# EAGLE schematic xio (EAGLE 9.5.0)

## Sheet 1 of 12: Block diagram
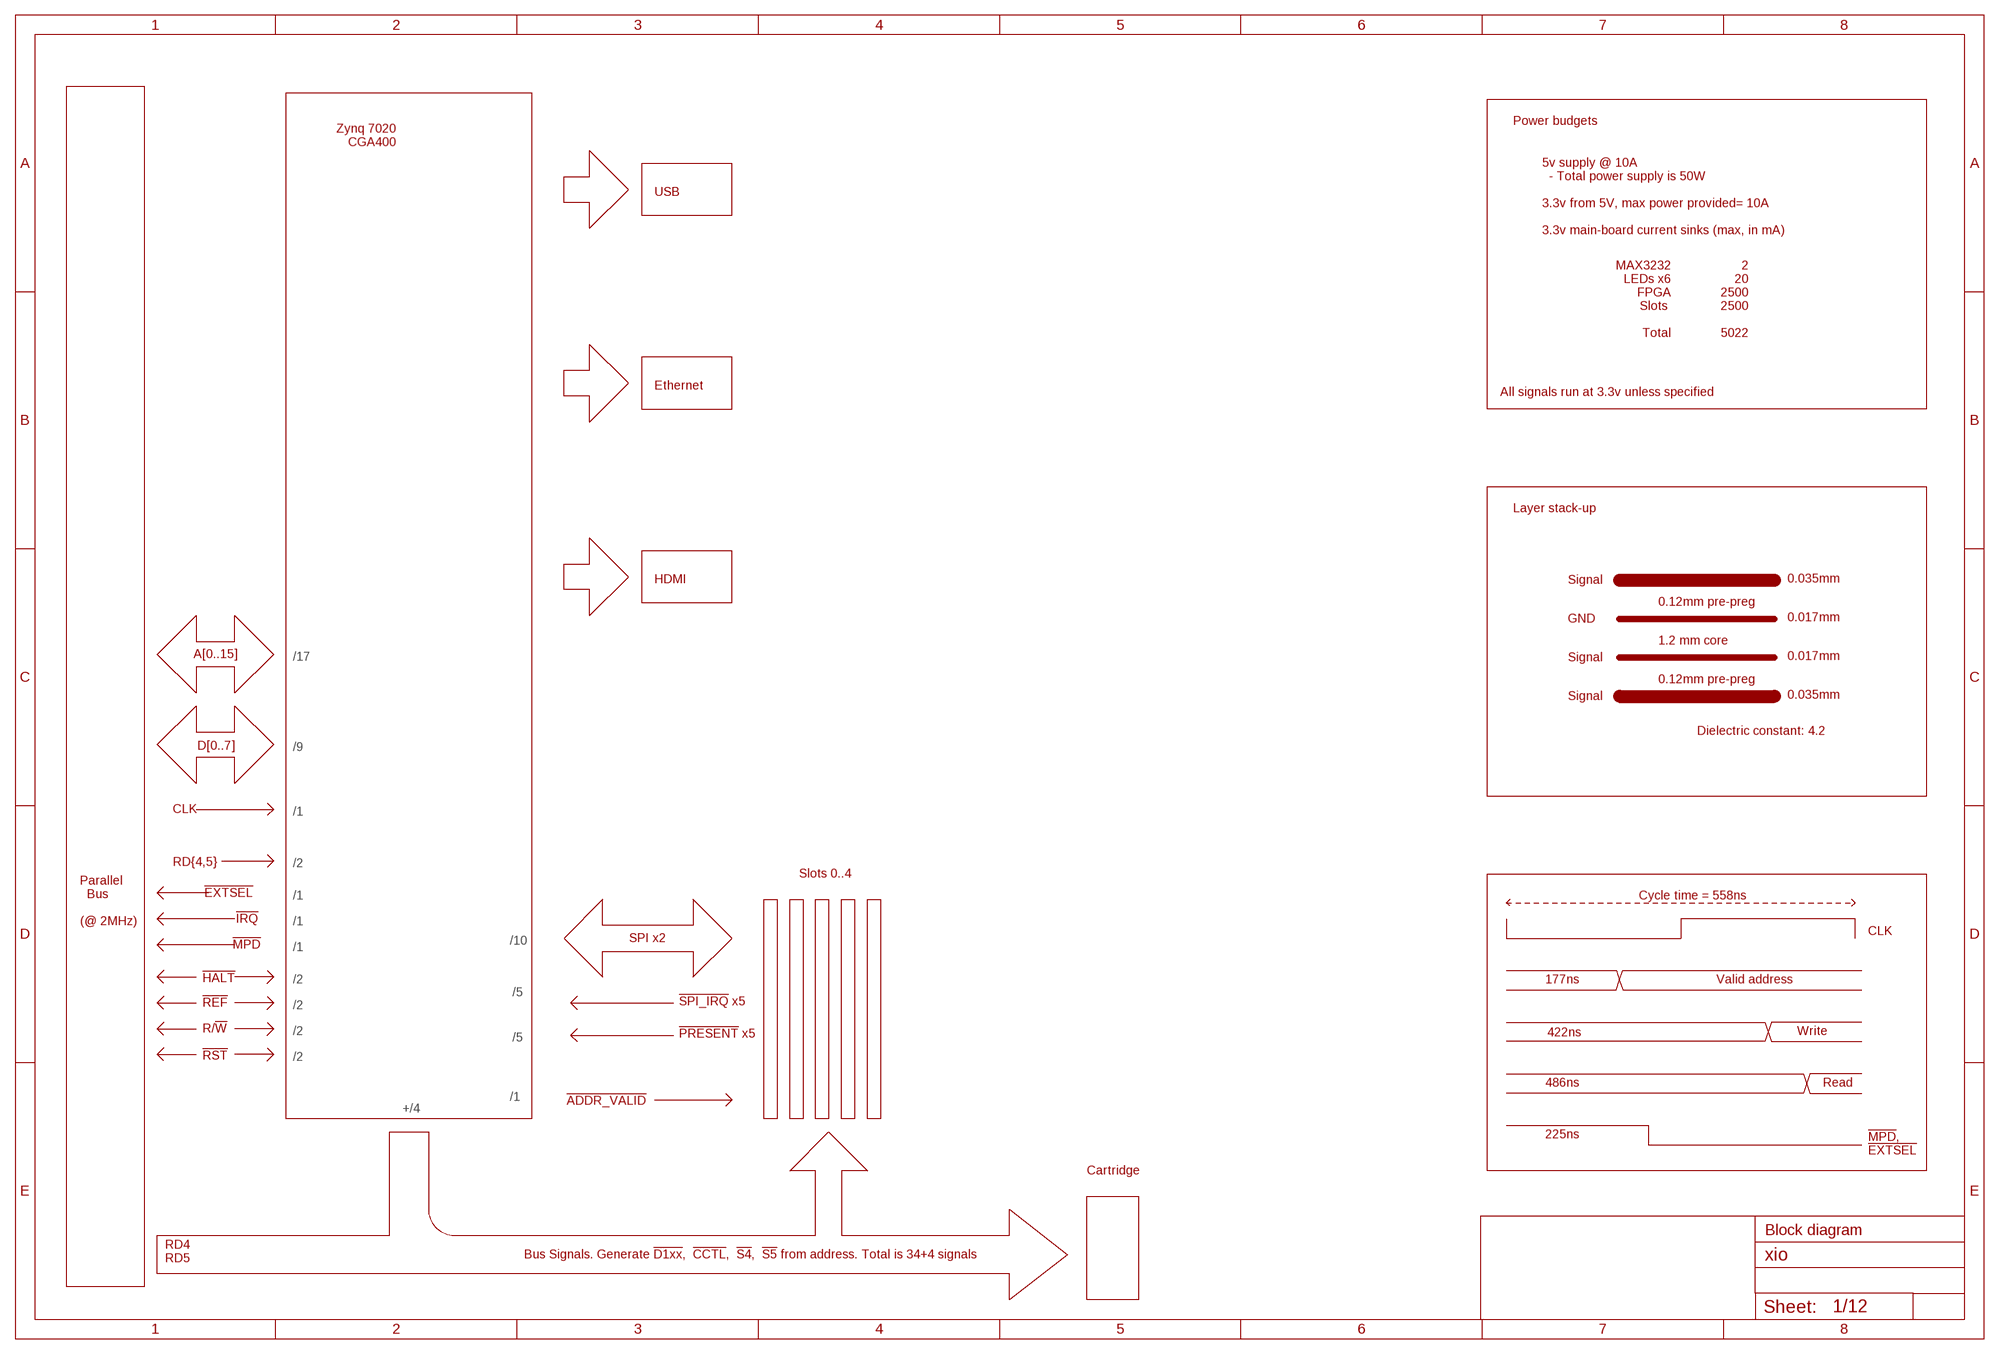
[diagram p0: schematic, sheet 1]

### Notes on the sheet
- Zynq 7020
   CGA400
- Power budgets
- USB
- 5v supply @ 10A
    - Total power supply is 50W
  
  3.3v from 5V, max power provided= 10A 
  
  3.3v main-board current sinks (max, in mA)
- MAX3232
  LEDs x6
  FPGA
  Slots 
  
  Total
- 2
  20
  2500
  2500
  
  5022
- Ethernet
- All signals run at 3.3v unless specified
- Layer stack-up
- HDMI | Signal | 0.035mm
- 0.12mm pre-preg
- GND | 0.017mm
- 1.2 mm core
- A[0..15] | /17 | Signal | 0.017mm
- 0.12mm pre-preg
- Signal | 0.035mm
- Dielectric constant: 4.2
- D[0..7] | /9
- CLK | /1
- RD{4,5} | /2
- Slots 0..4
- !EXTSEL!
- /1 | Cycle time = 558ns
- !IRQ!
- Parallel
    Bus
  
  (@ 2MHz)
- /1
- CLK
- !MPD! | SPI x2
- /10
- /1
- !HALT! | /2 | 177ns | Valid address
- /5
- !REF! | !SPI_IRQ! x5
- /2
- R/!W! | /2 | Write
- !PRESENT! x5 | 422ns
- /5
- !RST! | /2
- 486ns | Read
- /1
- !ADDR_VALID!
- +/4
- 225ns
- !MPD!,
  !EXTSEL!
- Cartridge
- Block diagram
- Bus Signals. Generate !D1xx!,  !CCTL!,  !S4!,  !S5! from address. Total is 34+4 signals
- RD4
  RD5

## Sheet 2 of 12: High voltage signalling
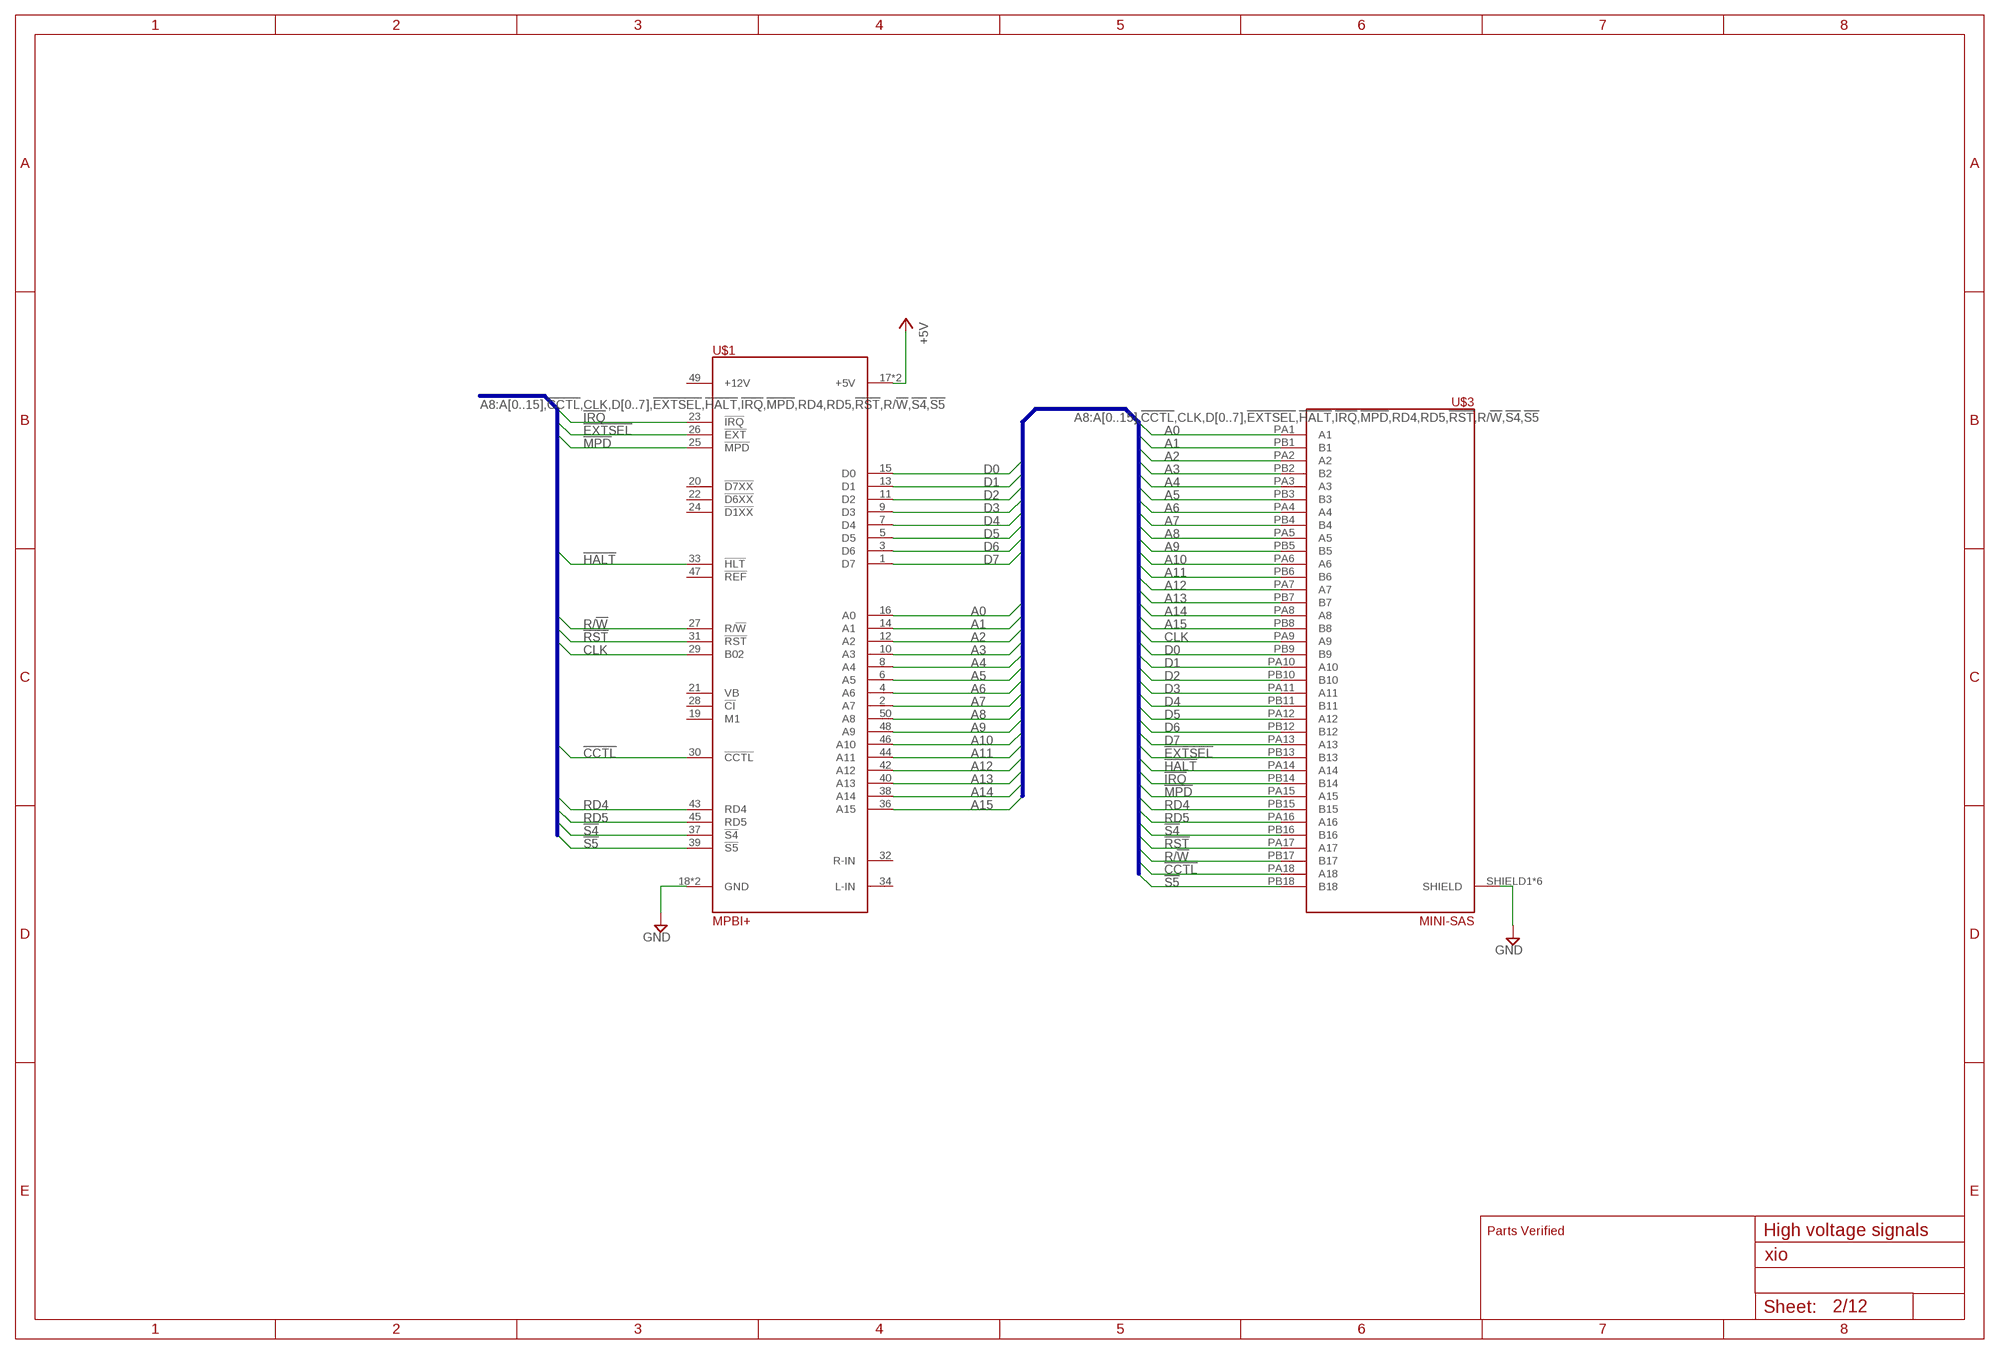
[diagram p1: schematic, sheet 2]

### Parts
U$1  MPBI+  [2X25]
U$3  MINI-SAS  [MINI-SAS]

### Nets
!CCTL!: U$1.30(!CCTL!) U$3.PA18(A18)
!EXTSEL!: U$1.26(!EXT!) U$3.PB13(B13)
!HALT!: U$1.33(!HLT!) U$3.PA14(A14)
!IRQ!: U$1.23(!IRQ!) U$3.PB14(B14)
!MPD!: U$1.25(!MPD!) U$3.PA15(A15)
!RST!: U$1.31(!RST!) U$3.PA17(A17)
!S4!: U$1.37(!S4!) U$3.PB16(B16)
!S5!: U$1.39(!S5!) U$3.PB18(B18)
+5V [Power]: U$1.17(+5V) U$1.41(+5V) ; also sheet 3,4,5
A0: U$1.16(A0) U$3.PA1(A1) ; also sheet 3,4,5
A1: U$1.14(A1) U$3.PB1(B1) ; also sheet 3,4,5
A2: U$1.12(A2) U$3.PA2(A2) ; also sheet 3,4,5
A3: U$1.10(A3) U$3.PB2(B2) ; also sheet 3,4,5
A4: U$1.8(A4) U$3.PA3(A3) ; also sheet 3,4,5
A5: U$1.6(A5) U$3.PB3(B3) ; also sheet 3,4,5
A6: U$1.4(A6) U$3.PA4(A4) ; also sheet 3,4,5
A7: U$1.2(A7) U$3.PB4(B4) ; also sheet 3,4,5
A8: U$1.50(A8) U$3.PA5(A5) ; also sheet 3,4,5
A9: U$1.48(A9) U$3.PB5(B5) ; also sheet 3,4,5
A10: U$1.46(A10) U$3.PA6(A6) ; also sheet 3,4,5
A11: U$1.44(A11) U$3.PB6(B6) ; also sheet 3,4,5
A12: U$1.42(A12) U$3.PA7(A7) ; also sheet 3,4,5
A13: U$1.40(A13) U$3.PB7(B7) ; also sheet 3,4,5
A14: U$1.38(A14) U$3.PA8(A8) ; also sheet 3,4,5
A15: U$1.36(A15) U$3.PB8(B8) ; also sheet 3,4,5
CLK: U$1.29(B02) U$3.PA9(A9)
D0: U$1.15(D0) U$3.PB9(B9) ; also sheet 3,4,5
D1: U$1.13(D1) U$3.PA10(A10) ; also sheet 3,4,5
D2: U$1.11(D2) U$3.PB10(B10) ; also sheet 3,4,5
D3: U$1.9(D3) U$3.PA11(A11) ; also sheet 3,4,5
D4: U$1.7(D4) U$3.PB11(B11) ; also sheet 3,4,5
D5: U$1.5(D5) U$3.PA12(A12) ; also sheet 3,4,5
D6: U$1.3(D6) U$3.PB12(B12) ; also sheet 3,4,5
D7: U$1.1(D7) U$3.PA13(A13) ; also sheet 3,4,5
GND: U$1.18(GND) U$1.35(GND) U$3.SHIELD1(SHIELD) U$3.SHIELD2(SHIELD) U$3.SHIELD3(SHIELD) U$3.SHIELD4(SHIELD) U$3.SHIELD5(SHIELD) U$3.SHIELD6(SHIELD) ; also sheet 3,4,5
R/!W!: U$1.27(R/!W!) U$3.PB17(B17)
RD4: U$1.43(RD4) U$3.PB15(B15)
RD5: U$1.45(RD5) U$3.PA16(A16)
Unconnected: U$1.19(M1) U$1.20(!D7XX!) U$1.21(VB) U$1.22(!D6XX!) U$1.24(!D1XX!) U$1.28(!CI!) U$1.32(R-IN) U$1.34(L-IN) U$1.47(!REF!) U$1.49(+12V)

### Buses
A8:A[0..15],!CCTL!,CLK,D[0..7],!EXTSEL!,!HALT!,!IRQ!,!MPD!,RD4,RD5,!RST!,R/!W!,!S4!,!S5!

### Notes on the sheet
- Parts Verified | High voltage signals

## Sheet 3 of 12: Expansion slots 0 & 1
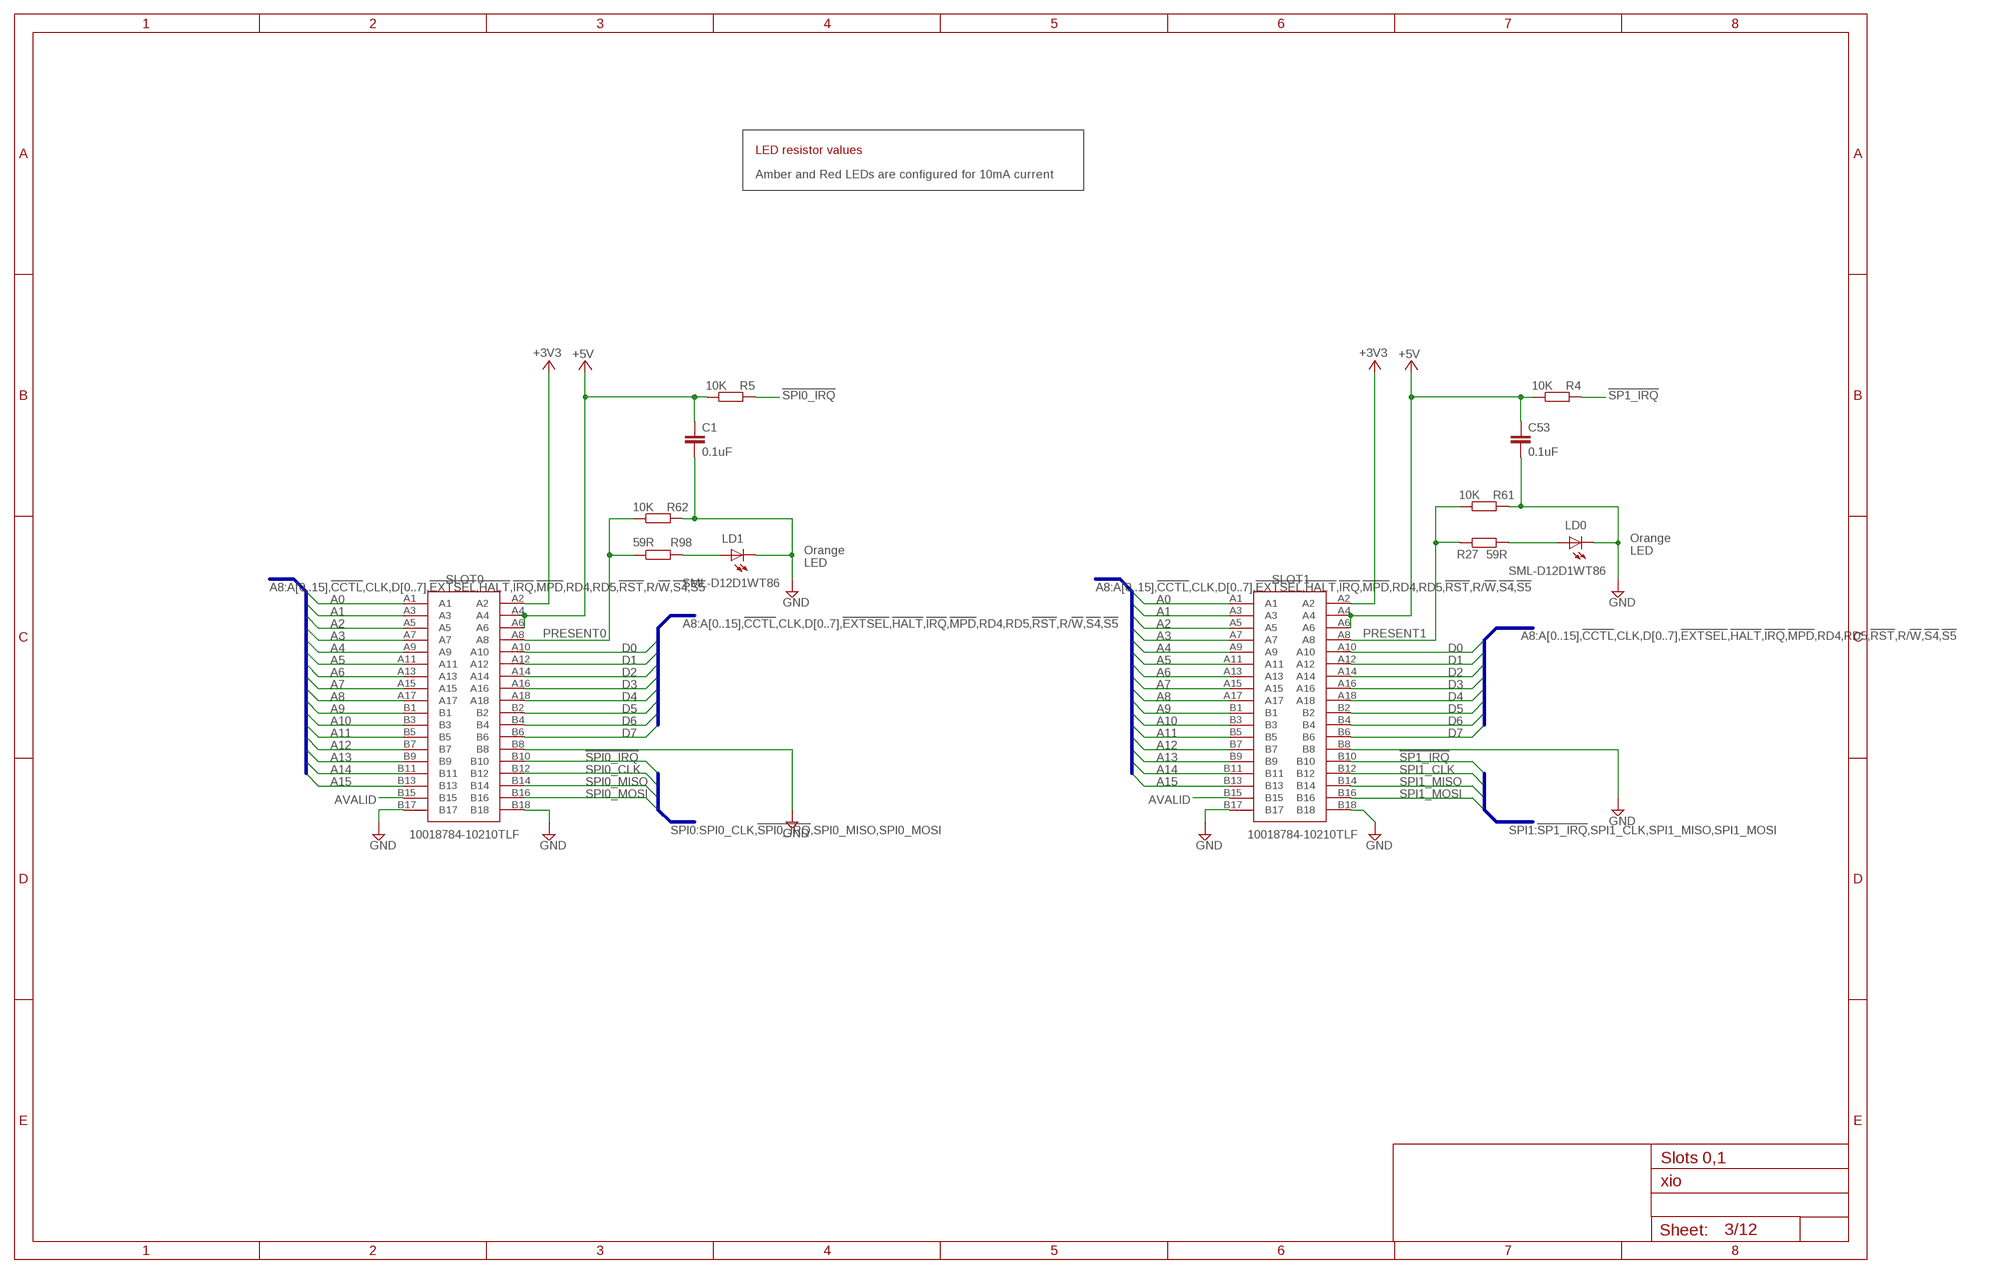
[diagram p2: schematic, sheet 3]

### Parts
C1  0.1uF  C-EUC0201  [C0201]
C53  0.1uF  C-EUC0201  [C0201]
LD0  SML-D12D1WT86  LEDCHIPLED_0603  [CHIPLED_0603]
LD1  SML-D12D1WT86  LEDCHIPLED_0603  [CHIPLED_0603]
R4  10K  R-EU_R0201  [R0201]
R5  10K  R-EU_R0201  [R0201]
R27  59R  R-EU_R0402  [R0402]
R61  10K  R-EU_R0201  [R0201]
R62  10K  R-EU_R0201  [R0201]
R98  59R  R-EU_R0402  [R0402]
SLOT0  10018784-10210TLF  [1001878410210TLF]
SLOT1  10018784-10210TLF  [1001878410210TLF]

### Nets
!SP1_IRQ!: R4.2 SLOT1.B10
!SPI0_IRQ!: R5.2 SLOT0.B10
+3V3 [lcd]: SLOT0.A2 SLOT1.A2 ; also sheet 4,5
+5V [Power]: C1.1 C53.1 R4.1 R5.1 SLOT0.A4 SLOT0.A6 SLOT1.A4 SLOT1.A6 ; also sheet 2,4,5
A0: SLOT0.A1 SLOT1.A1 ; also sheet 2,4,5
A1: SLOT0.A3 SLOT1.A3 ; also sheet 2,4,5
A2: SLOT0.A5 SLOT1.A5 ; also sheet 2,4,5
A3: SLOT0.A7 SLOT1.A7 ; also sheet 2,4,5
A4: SLOT0.A9 SLOT1.A9 ; also sheet 2,4,5
A5: SLOT0.A11 SLOT1.A11 ; also sheet 2,4,5
A6: SLOT0.A13 SLOT1.A13 ; also sheet 2,4,5
A7: SLOT0.A15 SLOT1.A15 ; also sheet 2,4,5
A8: SLOT0.A17 SLOT1.A17 ; also sheet 2,4,5
A9: SLOT0.B1 SLOT1.B1 ; also sheet 2,4,5
A10: SLOT0.B3 SLOT1.B3 ; also sheet 2,4,5
A11: SLOT0.B5 SLOT1.B5 ; also sheet 2,4,5
A12: SLOT0.B7 SLOT1.B7 ; also sheet 2,4,5
A13: SLOT0.B9 SLOT1.B9 ; also sheet 2,4,5
A14: SLOT0.B11 SLOT1.B11 ; also sheet 2,4,5
A15: SLOT0.B13 SLOT1.B13 ; also sheet 2,4,5
AVALID: SLOT0.B15 SLOT1.B15 ; also sheet 4,5
D0: SLOT0.A10 SLOT1.A10 ; also sheet 2,4,5
D1: SLOT0.A12 SLOT1.A12 ; also sheet 2,4,5
D2: SLOT0.A14 SLOT1.A14 ; also sheet 2,4,5
D3: SLOT0.A16 SLOT1.A16 ; also sheet 2,4,5
D4: SLOT0.A18 SLOT1.A18 ; also sheet 2,4,5
D5: SLOT0.B2 SLOT1.B2 ; also sheet 2,4,5
D6: SLOT0.B4 SLOT1.B4 ; also sheet 2,4,5
D7: SLOT0.B6 SLOT1.B6 ; also sheet 2,4,5
GND: C1.2 C53.2 LD0.C LD1.C R61.2 R62.2 SLOT0.B8 SLOT0.B17 SLOT0.B18 SLOT1.B8 SLOT1.B17 SLOT1.B18 ; also sheet 2,4,5
N$3: LD1.A R98.2
N$5: LD0.A R27.2
PRESENT0: R62.1 R98.1 SLOT0.A8
PRESENT1: R27.1 R61.1 SLOT1.A8
SPI0_CLK: SLOT0.B12
SPI0_MISO: SLOT0.B14
SPI0_MOSI: SLOT0.B16
SPI1_CLK: SLOT1.B12
SPI1_MISO: SLOT1.B14
SPI1_MOSI: SLOT1.B16

### Buses
A8:A[0..15],!CCTL!,CLK,D[0..7],!EXTSEL!,!HALT!,!IRQ!,!MPD!,RD4,RD5,!RST!,R/!W!,!S4!,!S5!
SPI1:!SP1_IRQ!,SPI1_CLK,SPI1_MISO,SPI1_MOSI
SPI0:SPI0_CLK,!SPI0_IRQ!,SPI0_MISO,SPI0_MOSI

### Notes on the sheet
- LED resistor values
- Amber and Red LEDs are configured for 10mA current
- Orange
  LED
- Orange
  LED
- Slots 0,1

## Sheet 4 of 12: Expansion slots 2 & 3
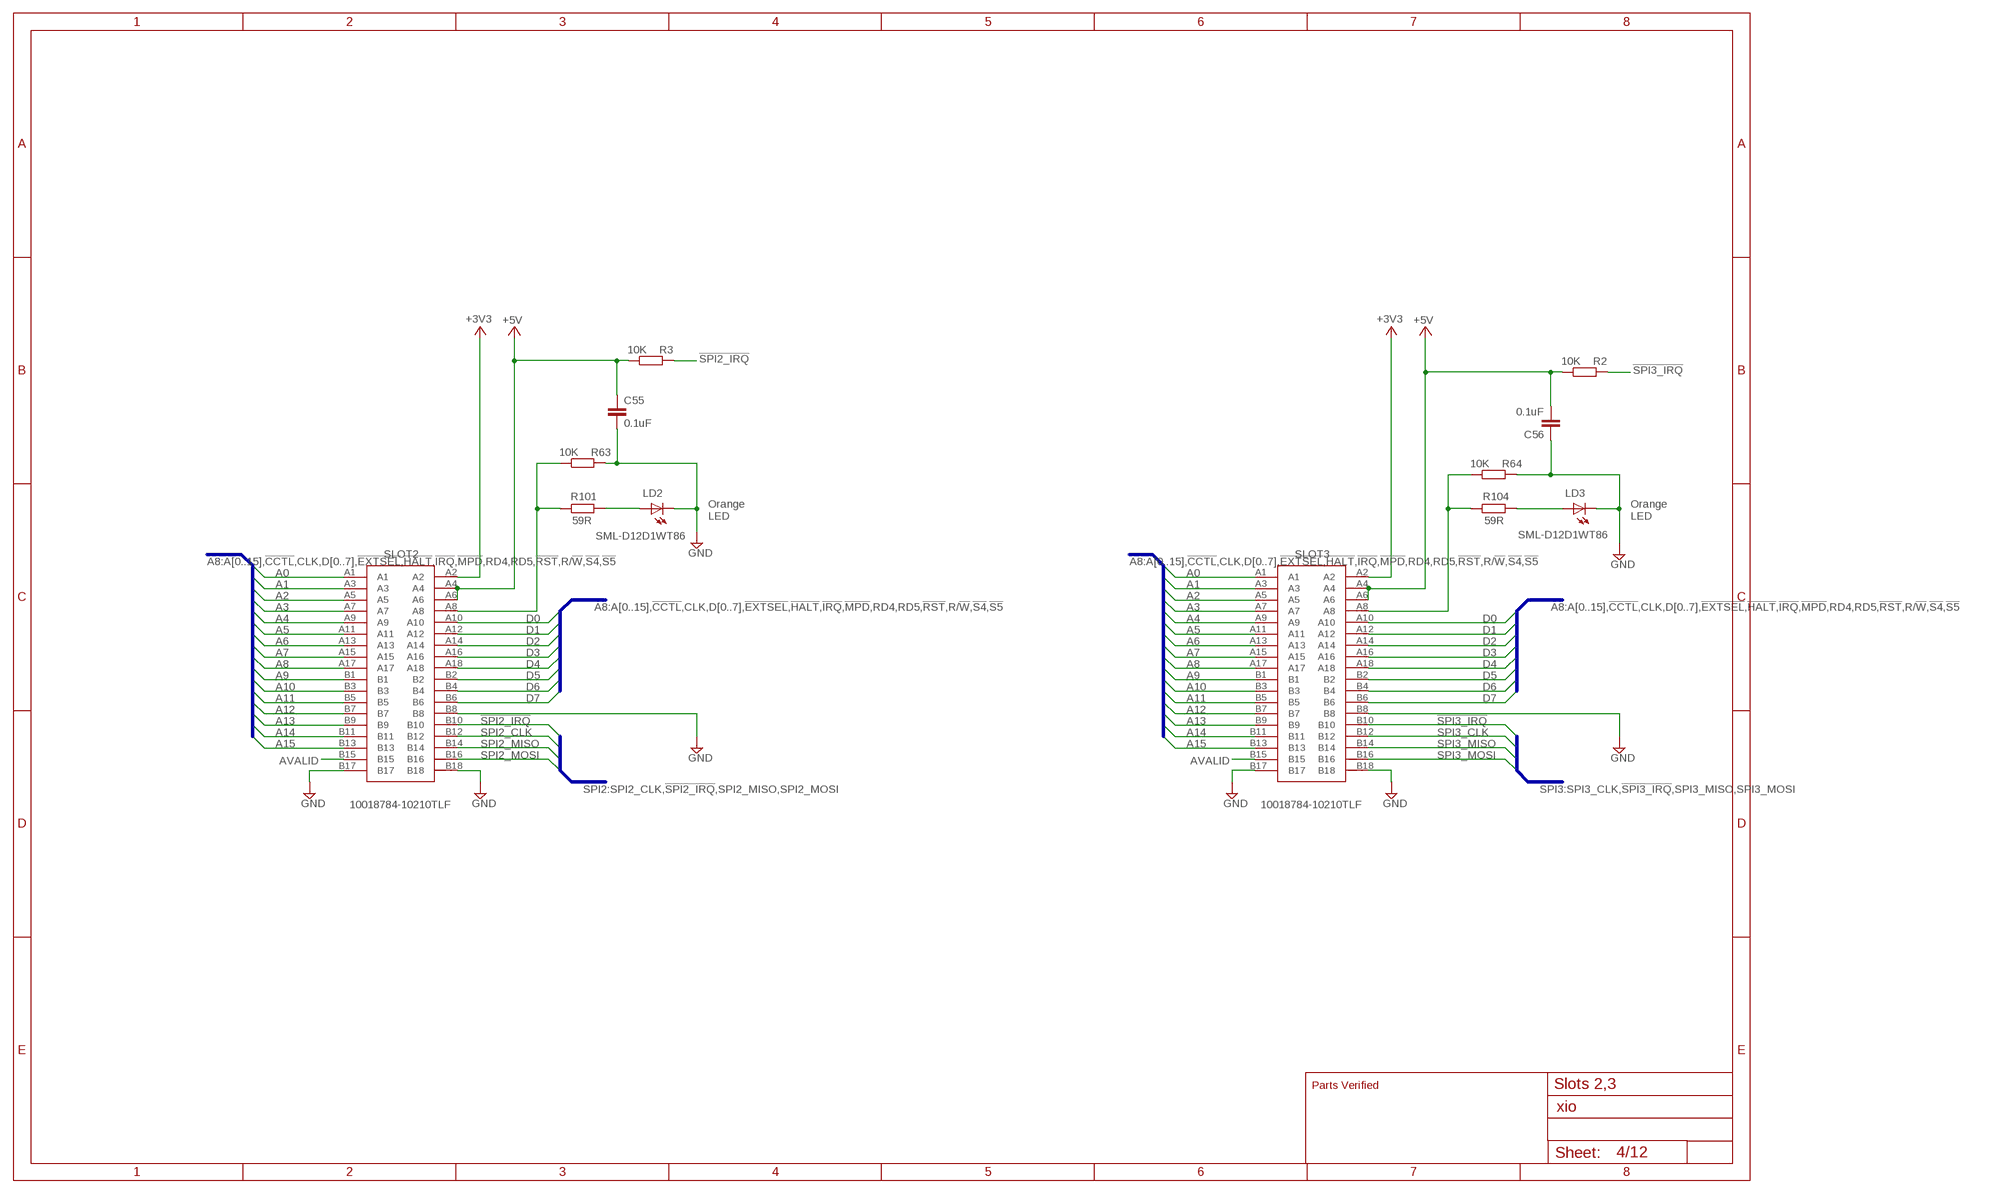
[diagram p3: schematic, sheet 4]

### Parts
C55  0.1uF  C-EUC0201  [C0201]
C56  0.1uF  C-EUC0201  [C0201]
LD2  SML-D12D1WT86  LEDCHIPLED_0603  [CHIPLED_0603]
LD3  SML-D12D1WT86  LEDCHIPLED_0603  [CHIPLED_0603]
R2  10K  R-EU_R0201  [R0201]
R3  10K  R-EU_R0201  [R0201]
R63  10K  R-EU_R0201  [R0201]
R64  10K  R-EU_R0201  [R0201]
R101  59R  R-EU_R0402  [R0402]
R104  59R  R-EU_R0402  [R0402]
SLOT2  10018784-10210TLF  [1001878410210TLF]
SLOT3  10018784-10210TLF  [1001878410210TLF]

### Nets
!SPI2_IRQ!: R3.2 SLOT2.B10
!SPI3_IRQ!: R2.2 SLOT3.B10
+3V3 [lcd]: SLOT2.A2 SLOT3.A2 ; also sheet 3,5
+5V [Power]: C55.1 C56.2 R2.1 R3.1 SLOT2.A4 SLOT2.A6 SLOT3.A4 SLOT3.A6 ; also sheet 2,3,5
A0: SLOT2.A1 SLOT3.A1 ; also sheet 2,3,5
A1: SLOT2.A3 SLOT3.A3 ; also sheet 2,3,5
A2: SLOT2.A5 SLOT3.A5 ; also sheet 2,3,5
A3: SLOT2.A7 SLOT3.A7 ; also sheet 2,3,5
A4: SLOT2.A9 SLOT3.A9 ; also sheet 2,3,5
A5: SLOT2.A11 SLOT3.A11 ; also sheet 2,3,5
A6: SLOT2.A13 SLOT3.A13 ; also sheet 2,3,5
A7: SLOT2.A15 SLOT3.A15 ; also sheet 2,3,5
A8: SLOT2.A17 SLOT3.A17 ; also sheet 2,3,5
A9: SLOT2.B1 SLOT3.B1 ; also sheet 2,3,5
A10: SLOT2.B3 SLOT3.B3 ; also sheet 2,3,5
A11: SLOT2.B5 SLOT3.B5 ; also sheet 2,3,5
A12: SLOT2.B7 SLOT3.B7 ; also sheet 2,3,5
A13: SLOT2.B9 SLOT3.B9 ; also sheet 2,3,5
A14: SLOT2.B11 SLOT3.B11 ; also sheet 2,3,5
A15: SLOT2.B13 SLOT3.B13 ; also sheet 2,3,5
AVALID: SLOT2.B15 SLOT3.B15 ; also sheet 3,5
D0: SLOT2.A10 SLOT3.A10 ; also sheet 2,3,5
D1: SLOT2.A12 SLOT3.A12 ; also sheet 2,3,5
D2: SLOT2.A14 SLOT3.A14 ; also sheet 2,3,5
D3: SLOT2.A16 SLOT3.A16 ; also sheet 2,3,5
D4: SLOT2.A18 SLOT3.A18 ; also sheet 2,3,5
D5: SLOT2.B2 SLOT3.B2 ; also sheet 2,3,5
D6: SLOT2.B4 SLOT3.B4 ; also sheet 2,3,5
D7: SLOT2.B6 SLOT3.B6 ; also sheet 2,3,5
GND: C55.2 C56.1 LD2.C LD3.C R63.2 R64.2 SLOT2.B8 SLOT2.B17 SLOT2.B18 SLOT3.B8 SLOT3.B17 SLOT3.B18 ; also sheet 2,3,5
N$1: LD2.A R101.2
N$6: R64.1 R104.1 SLOT3.A8
N$7: R63.1 R101.1 SLOT2.A8
N$8: LD3.A R104.2
SPI2_CLK: SLOT2.B12
SPI2_MISO: SLOT2.B14
SPI2_MOSI: SLOT2.B16
SPI3_CLK: SLOT3.B12
SPI3_MISO: SLOT3.B14
SPI3_MOSI: SLOT3.B16

### Buses
A8:A[0..15],!CCTL!,CLK,D[0..7],!EXTSEL!,!HALT!,!IRQ!,!MPD!,RD4,RD5,!RST!,R/!W!,!S4!,!S5!
SPI3:SPI3_CLK,!SPI3_IRQ!,SPI3_MISO,SPI3_MOSI
SPI2:SPI2_CLK,!SPI2_IRQ!,SPI2_MISO,SPI2_MOSI

### Notes on the sheet
- Orange
  LED
- Orange
  LED
- Parts Verified | Slots 2,3

## Sheet 5 of 12: Expansion slot 4 and Internal
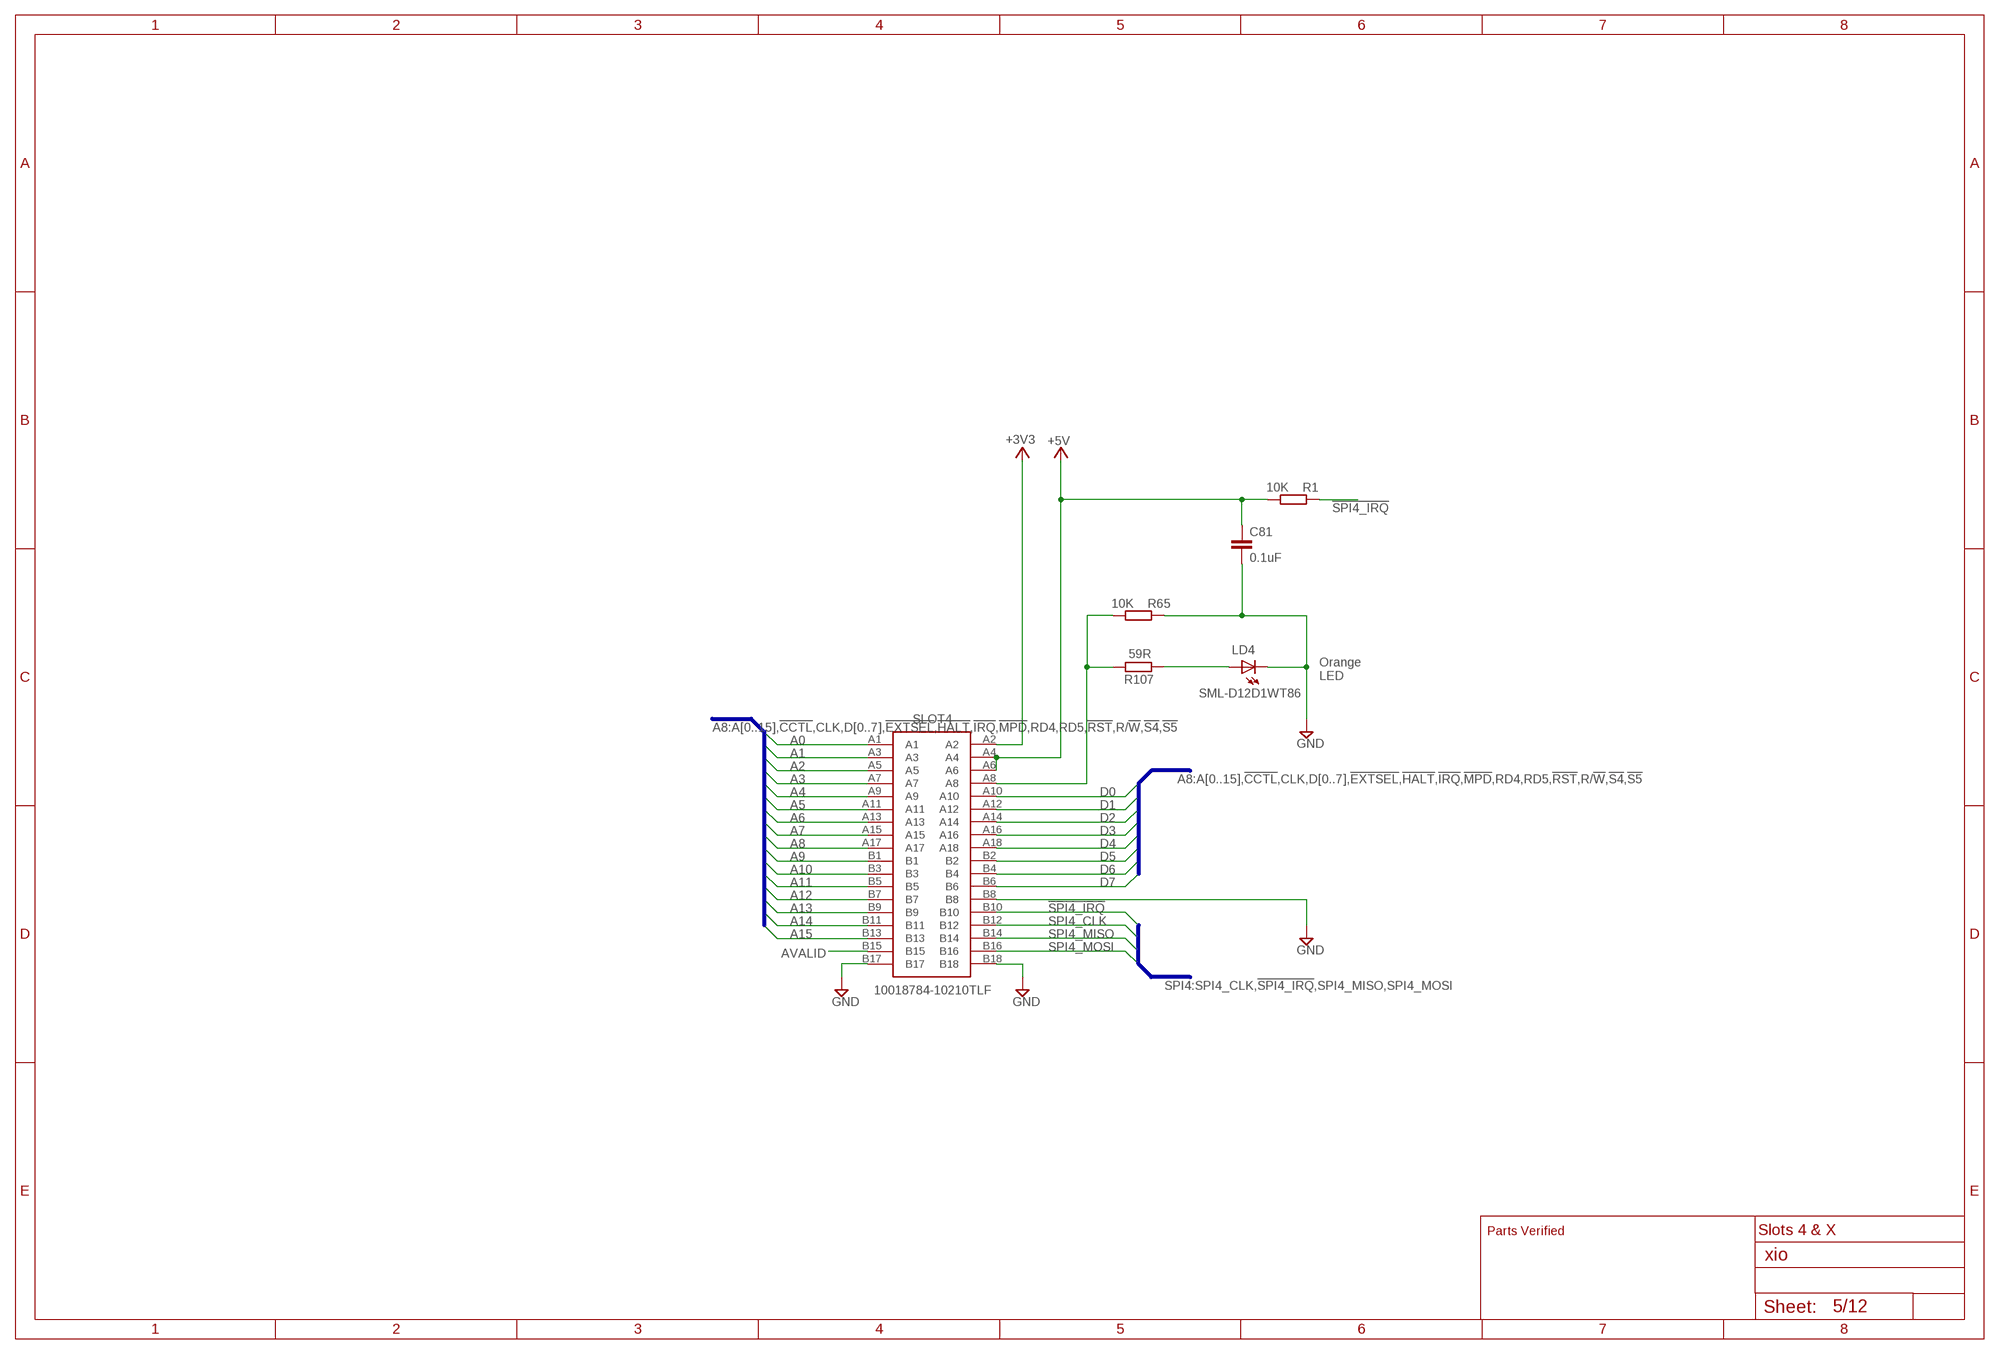
[diagram p4: schematic, sheet 5]

### Parts
C81  0.1uF  C-EUC0201  [C0201]
LD4  SML-D12D1WT86  LEDCHIPLED_0603  [CHIPLED_0603]
R1  10K  R-EU_R0201  [R0201]
R65  10K  R-EU_R0201  [R0201]
R107  59R  R-EU_R0402  [R0402]
SLOT4  10018784-10210TLF  [1001878410210TLF]

### Nets
!SPI4_IRQ!: R1.2 SLOT4.B10
+3V3 [lcd]: SLOT4.A2 ; also sheet 3,4
+5V [Power]: C81.1 R1.1 SLOT4.A4 SLOT4.A6 ; also sheet 2,3,4
A0: SLOT4.A1 ; also sheet 2,3,4
A1: SLOT4.A3 ; also sheet 2,3,4
A2: SLOT4.A5 ; also sheet 2,3,4
A3: SLOT4.A7 ; also sheet 2,3,4
A4: SLOT4.A9 ; also sheet 2,3,4
A5: SLOT4.A11 ; also sheet 2,3,4
A6: SLOT4.A13 ; also sheet 2,3,4
A7: SLOT4.A15 ; also sheet 2,3,4
A8: SLOT4.A17 ; also sheet 2,3,4
A9: SLOT4.B1 ; also sheet 2,3,4
A10: SLOT4.B3 ; also sheet 2,3,4
A11: SLOT4.B5 ; also sheet 2,3,4
A12: SLOT4.B7 ; also sheet 2,3,4
A13: SLOT4.B9 ; also sheet 2,3,4
A14: SLOT4.B11 ; also sheet 2,3,4
A15: SLOT4.B13 ; also sheet 2,3,4
AVALID: SLOT4.B15 ; also sheet 3,4
D0: SLOT4.A10 ; also sheet 2,3,4
D1: SLOT4.A12 ; also sheet 2,3,4
D2: SLOT4.A14 ; also sheet 2,3,4
D3: SLOT4.A16 ; also sheet 2,3,4
D4: SLOT4.A18 ; also sheet 2,3,4
D5: SLOT4.B2 ; also sheet 2,3,4
D6: SLOT4.B4 ; also sheet 2,3,4
D7: SLOT4.B6 ; also sheet 2,3,4
GND: C81.2 LD4.C R65.2 SLOT4.B8 SLOT4.B17 SLOT4.B18 ; also sheet 2,3,4
N$9: R65.1 R107.1 SLOT4.A8
N$10: LD4.A R107.2
SPI4_CLK: SLOT4.B12
SPI4_MISO: SLOT4.B14
SPI4_MOSI: SLOT4.B16

### Buses
A8:A[0..15],!CCTL!,CLK,D[0..7],!EXTSEL!,!HALT!,!IRQ!,!MPD!,RD4,RD5,!RST!,R/!W!,!S4!,!S5!
SPI4:SPI4_CLK,!SPI4_IRQ!,SPI4_MISO,SPI4_MOSI

### Notes on the sheet
- Orange
  LED
- Parts Verified | Slots 4 & X

## Sheet 6 of 12
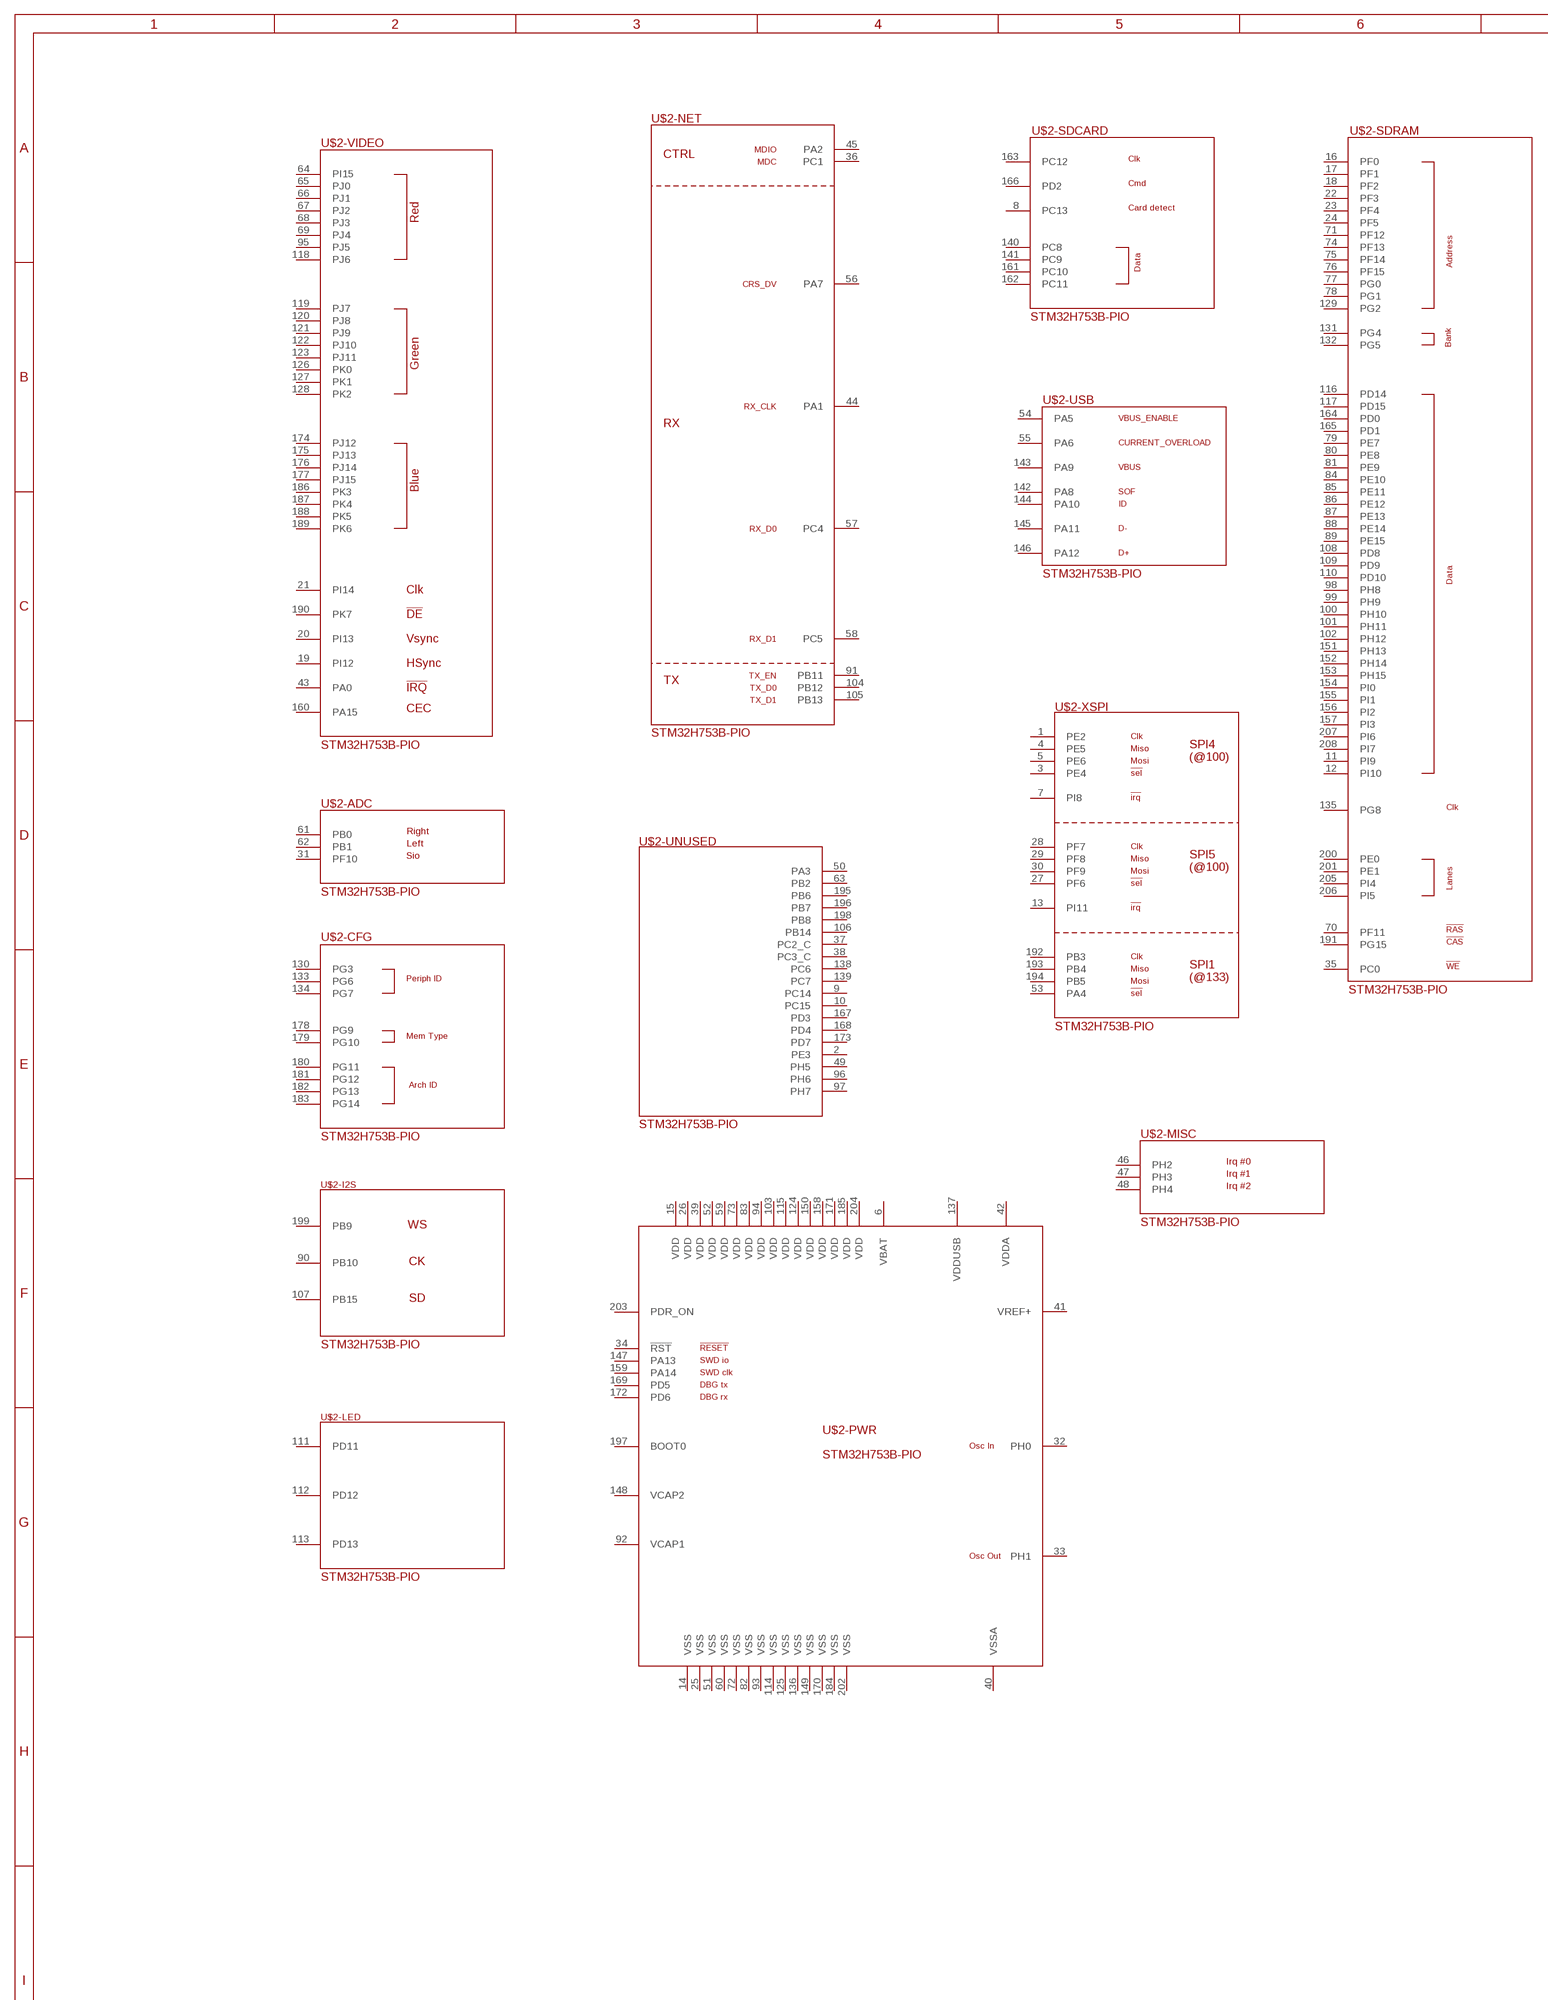
[diagram p5: schematic, sheet 6, part 1 of 2]
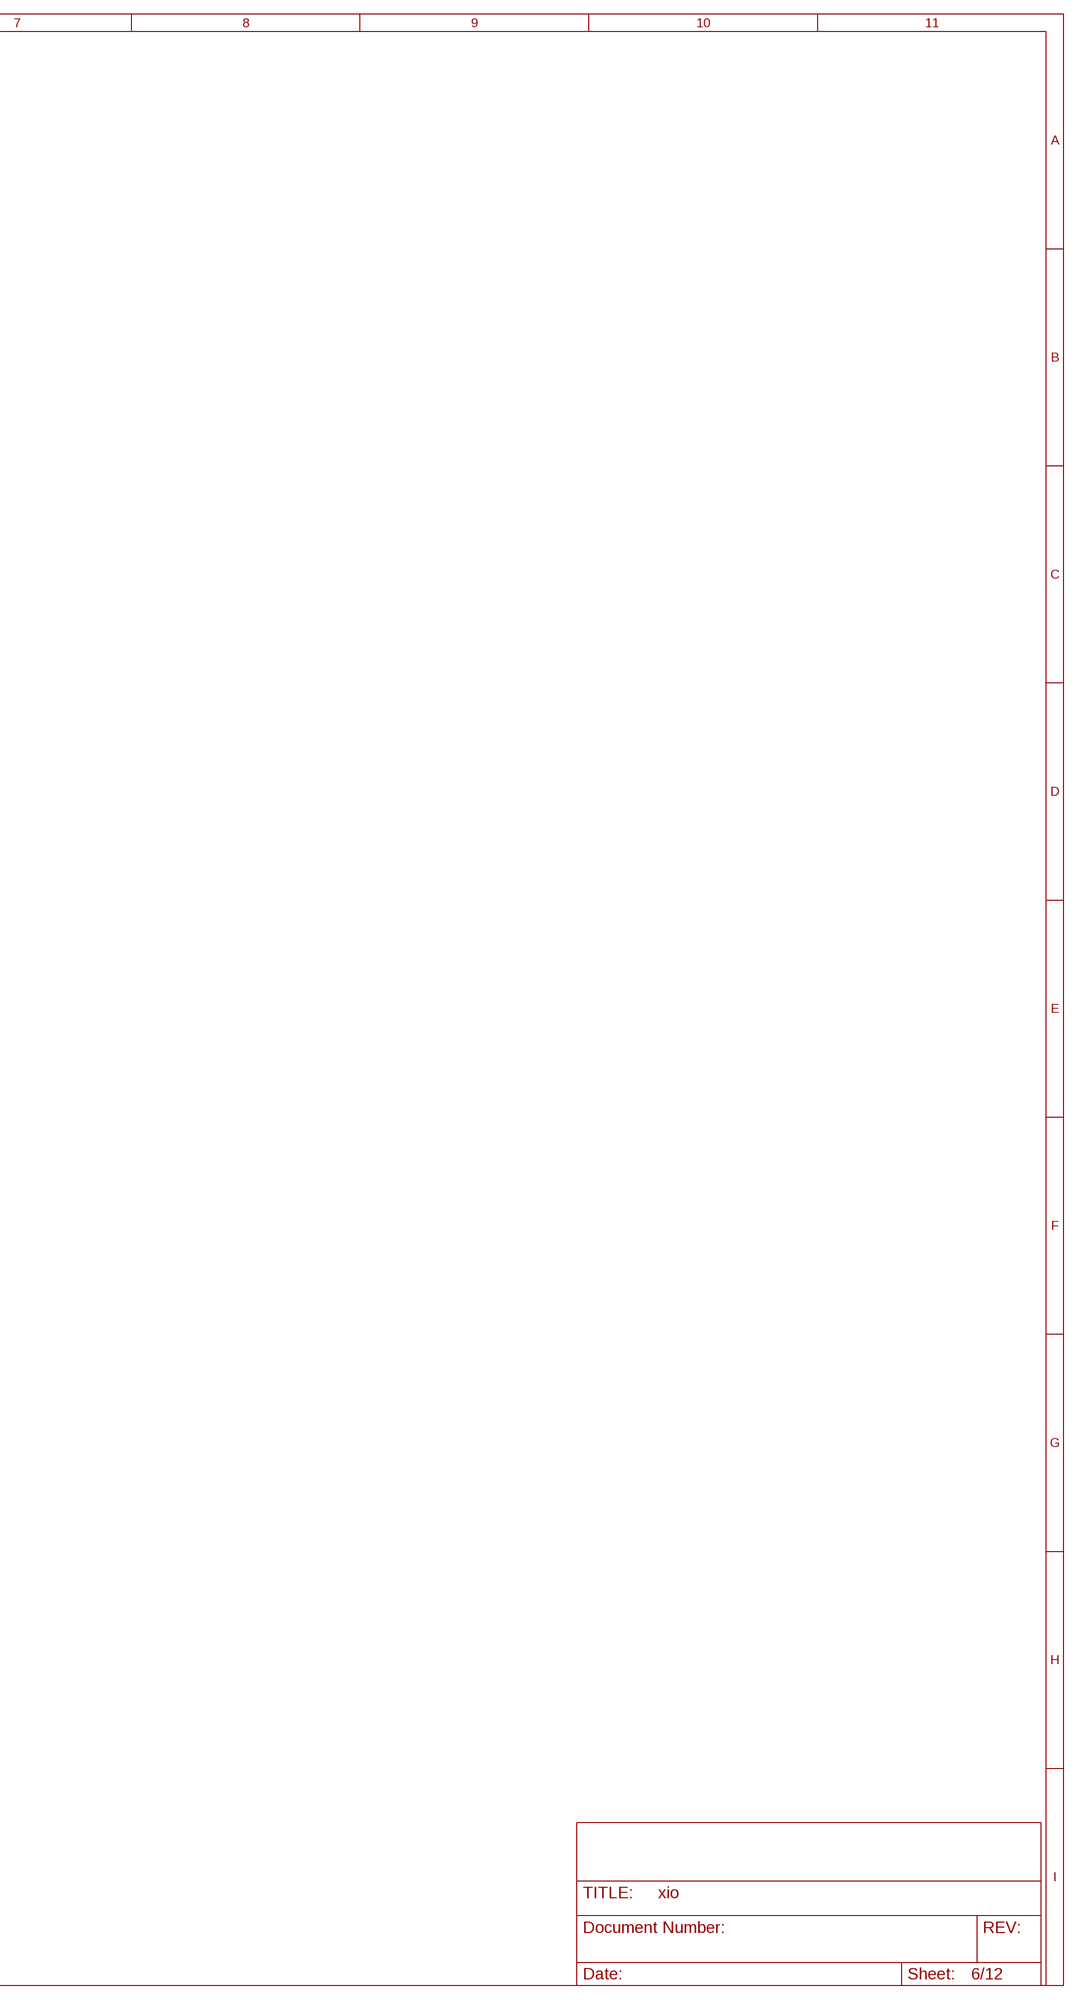
[diagram p6: schematic, sheet 6, part 2 of 2]

### Parts
U$2  STM32H753B-PIO  [PQFP208]
Unconnected: U$2.1(-XSPI:PE2) U$2.2(-UNUSED:PE3) U$2.3(-XSPI:PE4) U$2.4(-XSPI:PE5) U$2.5(-XSPI:PE6) U$2.6(-PWR:VBAT) U$2.7(-XSPI:PI8) U$2.8(-SDCARD:PC13) U$2.9(-UNUSED:PC14) U$2.10(-UNUSED:PC15) U$2.11(-SDRAM:PI9) U$2.12(-SDRAM:PI10) U$2.13(-XSPI:PI11) U$2.14(-PWR:VSS) U$2.15(-PWR:VDD) U$2.16(-SDRAM:PF0) U$2.17(-SDRAM:PF1) U$2.18(-SDRAM:PF2) U$2.19(-VIDEO:PI12) U$2.20(-VIDEO:PI13) U$2.21(-VIDEO:PI14) U$2.22(-SDRAM:PF3) U$2.23(-SDRAM:PF4) U$2.24(-SDRAM:PF5) U$2.25(-PWR:VSS) U$2.26(-PWR:VDD) U$2.27(-XSPI:PF6) U$2.28(-XSPI:PF7) U$2.29(-XSPI:PF8) U$2.30(-XSPI:PF9) U$2.31(-ADC:PF10) U$2.32(-PWR:PH0) U$2.33(-PWR:PH1) U$2.34(-PWR:!RST!) U$2.35(-SDRAM:PC0) U$2.36(-NET:PC1) U$2.37(-UNUSED:PC2_C) U$2.38(-UNUSED:PC3_C) U$2.39(-PWR:VDD) U$2.40(-PWR:VSSA) U$2.41(-PWR:VREF+) U$2.42(-PWR:VDDA) U$2.43(-VIDEO:PA0) U$2.44(-NET:PA1) U$2.45(-NET:PA2) U$2.46(-MISC:PH2) U$2.47(-MISC:PH3) U$2.48(-MISC:PH4) U$2.49(-UNUSED:PH5) U$2.50(-UNUSED:PA3) U$2.51(-PWR:VSS) U$2.52(-PWR:VDD) U$2.53(-XSPI:PA4) U$2.54(-USB:PA5) U$2.55(-USB:PA6) U$2.56(-NET:PA7) U$2.57(-NET:PC4) U$2.58(-NET:PC5) U$2.59(-PWR:VDD) U$2.60(-PWR:VSS) U$2.61(-ADC:PB0) U$2.62(-ADC:PB1) U$2.63(-UNUSED:PB2) U$2.64(-VIDEO:PI15) U$2.65(-VIDEO:PJ0) U$2.66(-VIDEO:PJ1) U$2.67(-VIDEO:PJ2) U$2.68(-VIDEO:PJ3) U$2.69(-VIDEO:PJ4) U$2.70(-SDRAM:PF11) U$2.71(-SDRAM:PF12) U$2.72(-PWR:VSS) U$2.73(-PWR:VDD) U$2.74(-SDRAM:PF13) U$2.75(-SDRAM:PF14) U$2.76(-SDRAM:PF15) U$2.77(-SDRAM:PG0) U$2.78(-SDRAM:PG1) U$2.79(-SDRAM:PE7) U$2.80(-SDRAM:PE8) U$2.81(-SDRAM:PE9) U$2.82(-PWR:VSS) U$2.83(-PWR:VDD) U$2.84(-SDRAM:PE10) U$2.85(-SDRAM:PE11) U$2.86(-SDRAM:PE12) U$2.87(-SDRAM:PE13) U$2.88(-SDRAM:PE14) U$2.89(-SDRAM:PE15) U$2.90(-I2S:PB10) U$2.91(-NET:PB11) U$2.92(-PWR:VCAP1) U$2.93(-PWR:VSS) U$2.94(-PWR:VDD) U$2.95(-VIDEO:PJ5) U$2.96(-UNUSED:PH6) U$2.97(-UNUSED:PH7) U$2.98(-SDRAM:PH8) U$2.99(-SDRAM:PH9) U$2.100(-SDRAM:PH10) U$2.101(-SDRAM:PH11) U$2.102(-SDRAM:PH12) U$2.103(-PWR:VDD) U$2.104(-NET:PB12) U$2.105(-NET:PB13) U$2.106(-UNUSED:PB14) U$2.107(-I2S:PB15) U$2.108(-SDRAM:PD8) U$2.109(-SDRAM:PD9) U$2.110(-SDRAM:PD10) U$2.111(-LED:PD11) U$2.112(-LED:PD12) U$2.113(-LED:PD13) U$2.114(-PWR:VSS) U$2.115(-PWR:VDD) U$2.116(-SDRAM:PD14) U$2.117(-SDRAM:PD15) U$2.118(-VIDEO:PJ6) U$2.119(-VIDEO:PJ7) U$2.120(-VIDEO:PJ8) U$2.121(-VIDEO:PJ9) U$2.122(-VIDEO:PJ10) U$2.123(-VIDEO:PJ11) U$2.124(-PWR:VDD) U$2.125(-PWR:VSS) U$2.126(-VIDEO:PK0) U$2.127(-VIDEO:PK1) U$2.128(-VIDEO:PK2) U$2.129(-SDRAM:PG2) U$2.130(-CFG:PG3) U$2.131(-SDRAM:PG4) U$2.132(-SDRAM:PG5) U$2.133(-CFG:PG6) U$2.134(-CFG:PG7) U$2.135(-SDRAM:PG8) U$2.136(-PWR:VSS) U$2.137(-PWR:VDDUSB) U$2.138(-UNUSED:PC6) U$2.139(-UNUSED:PC7) U$2.140(-SDCARD:PC8) U$2.141(-SDCARD:PC9) U$2.142(-USB:PA8) U$2.143(-USB:PA9) U$2.144(-USB:PA10) U$2.145(-USB:PA11) U$2.146(-USB:PA12) U$2.147(-PWR:PA13) U$2.148(-PWR:VCAP2) U$2.149(-PWR:VSS) U$2.150(-PWR:VDD) U$2.151(-SDRAM:PH13) U$2.152(-SDRAM:PH14) U$2.153(-SDRAM:PH15) U$2.154(-SDRAM:PI0) U$2.155(-SDRAM:PI1) U$2.156(-SDRAM:PI2) U$2.157(-SDRAM:PI3) U$2.158(-PWR:VDD) U$2.159(-PWR:PA14) U$2.160(-VIDEO:PA15) U$2.161(-SDCARD:PC10) U$2.162(-SDCARD:PC11) U$2.163(-SDCARD:PC12) U$2.164(-SDRAM:PD0) U$2.165(-SDRAM:PD1) U$2.166(-SDCARD:PD2) U$2.167(-UNUSED:PD3) U$2.168(-UNUSED:PD4) U$2.169(-PWR:PD5) U$2.170(-PWR:VSS) U$2.171(-PWR:VDD) U$2.172(-PWR:PD6) U$2.173(-UNUSED:PD7) U$2.174(-VIDEO:PJ12) U$2.175(-VIDEO:PJ13) U$2.176(-VIDEO:PJ14) U$2.177(-VIDEO:PJ15) U$2.178(-CFG:PG9) U$2.179(-CFG:PG10) U$2.180(-CFG:PG11) U$2.181(-CFG:PG12) U$2.182(-CFG:PG13) U$2.183(-CFG:PG14) U$2.184(-PWR:VSS) U$2.185(-PWR:VDD) U$2.186(-VIDEO:PK3) U$2.187(-VIDEO:PK4) U$2.188(-VIDEO:PK5) U$2.189(-VIDEO:PK6) U$2.190(-VIDEO:PK7) U$2.191(-SDRAM:PG15) U$2.192(-XSPI:PB3) U$2.193(-XSPI:PB4) U$2.194(-XSPI:PB5) U$2.195(-UNUSED:PB6) U$2.196(-UNUSED:PB7) U$2.197(-PWR:BOOT0) U$2.198(-UNUSED:PB8) U$2.199(-I2S:PB9) U$2.200(-SDRAM:PE0) U$2.201(-SDRAM:PE1) U$2.202(-PWR:VSS) U$2.203(-PWR:PDR_ON) U$2.204(-PWR:VDD) U$2.205(-SDRAM:PI4) U$2.206(-SDRAM:PI5) U$2.207(-SDRAM:PI6) U$2.208(-SDRAM:PI7)

## Sheet 7 of 12
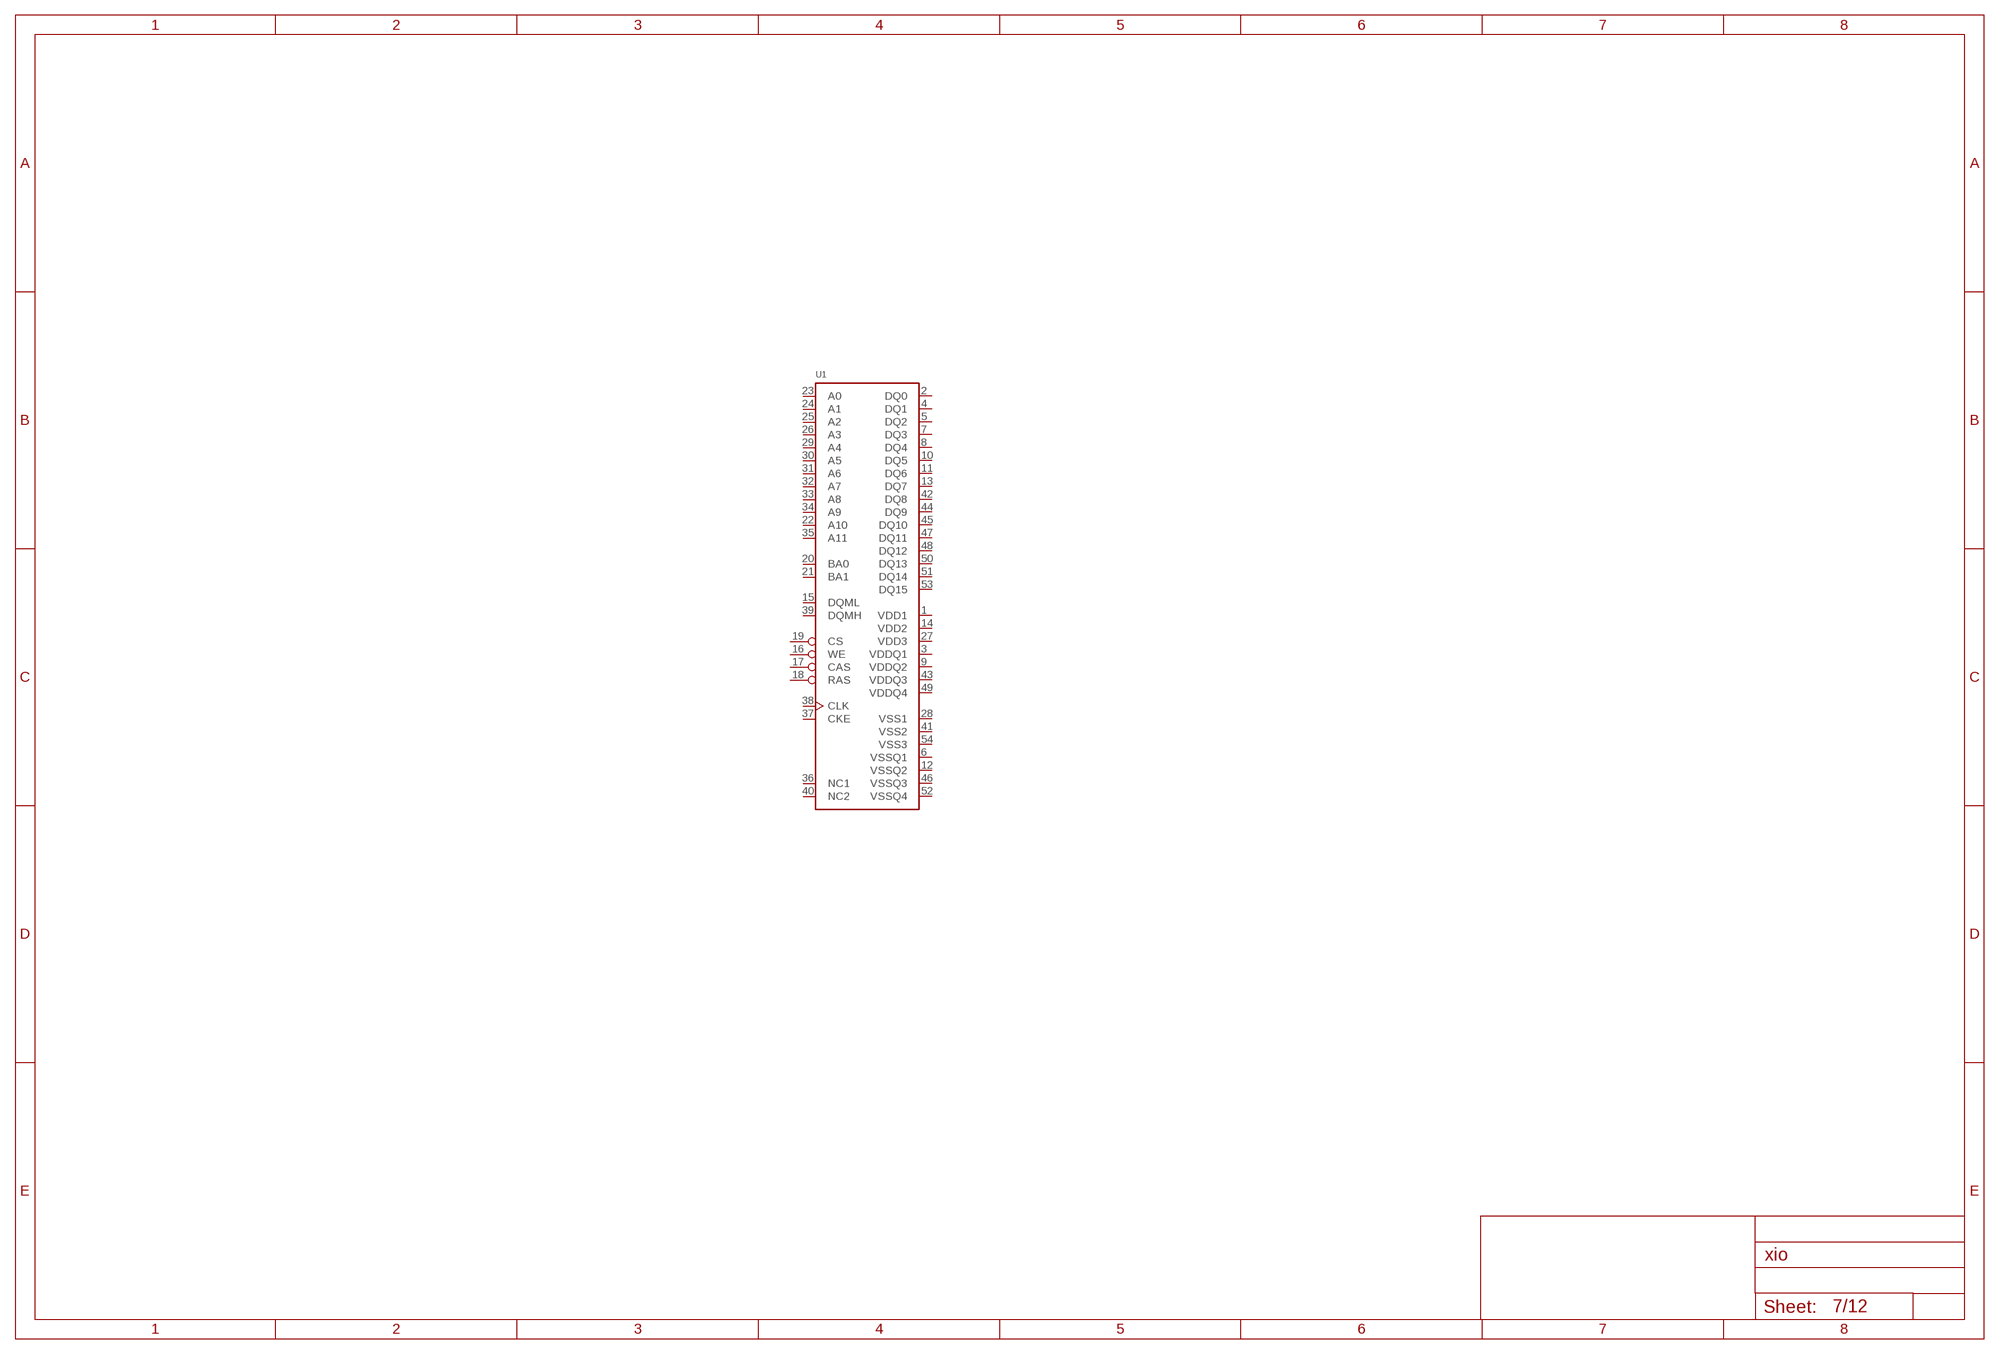
[diagram p7: schematic, sheet 7]

### Parts
U1  SDRAM_54TSOP  [TSOP54-400]
Unconnected: U1.1(VDD1) U1.2(DQ0) U1.3(VDDQ1) U1.4(DQ1) U1.5(DQ2) U1.6(VSSQ1) U1.7(DQ3) U1.8(DQ4) U1.9(VDDQ2) U1.10(DQ5) U1.11(DQ6) U1.12(VSSQ2) U1.13(DQ7) U1.14(VDD2) U1.15(DQML) U1.16(WE) U1.17(CAS) U1.18(RAS) U1.19(CS) U1.20(BA0) U1.21(BA1) U1.22(A10) U1.23(A0) U1.24(A1) U1.25(A2) U1.26(A3) U1.27(VDD3) U1.28(VSS1) U1.29(A4) U1.30(A5) U1.31(A6) U1.32(A7) U1.33(A8) U1.34(A9) U1.35(A11) U1.36(NC1) U1.37(CKE) U1.38(CLK) U1.39(DQMH) U1.40(NC2) U1.41(VSS2) U1.42(DQ8) U1.43(VDDQ3) U1.44(DQ9) U1.45(DQ10) U1.46(VSSQ3) U1.47(DQ11) U1.48(DQ12) U1.49(VDDQ4) U1.50(DQ13) U1.51(DQ14) U1.52(VSSQ4) U1.53(DQ15) U1.54(VSS3)

## Sheet 8 of 12
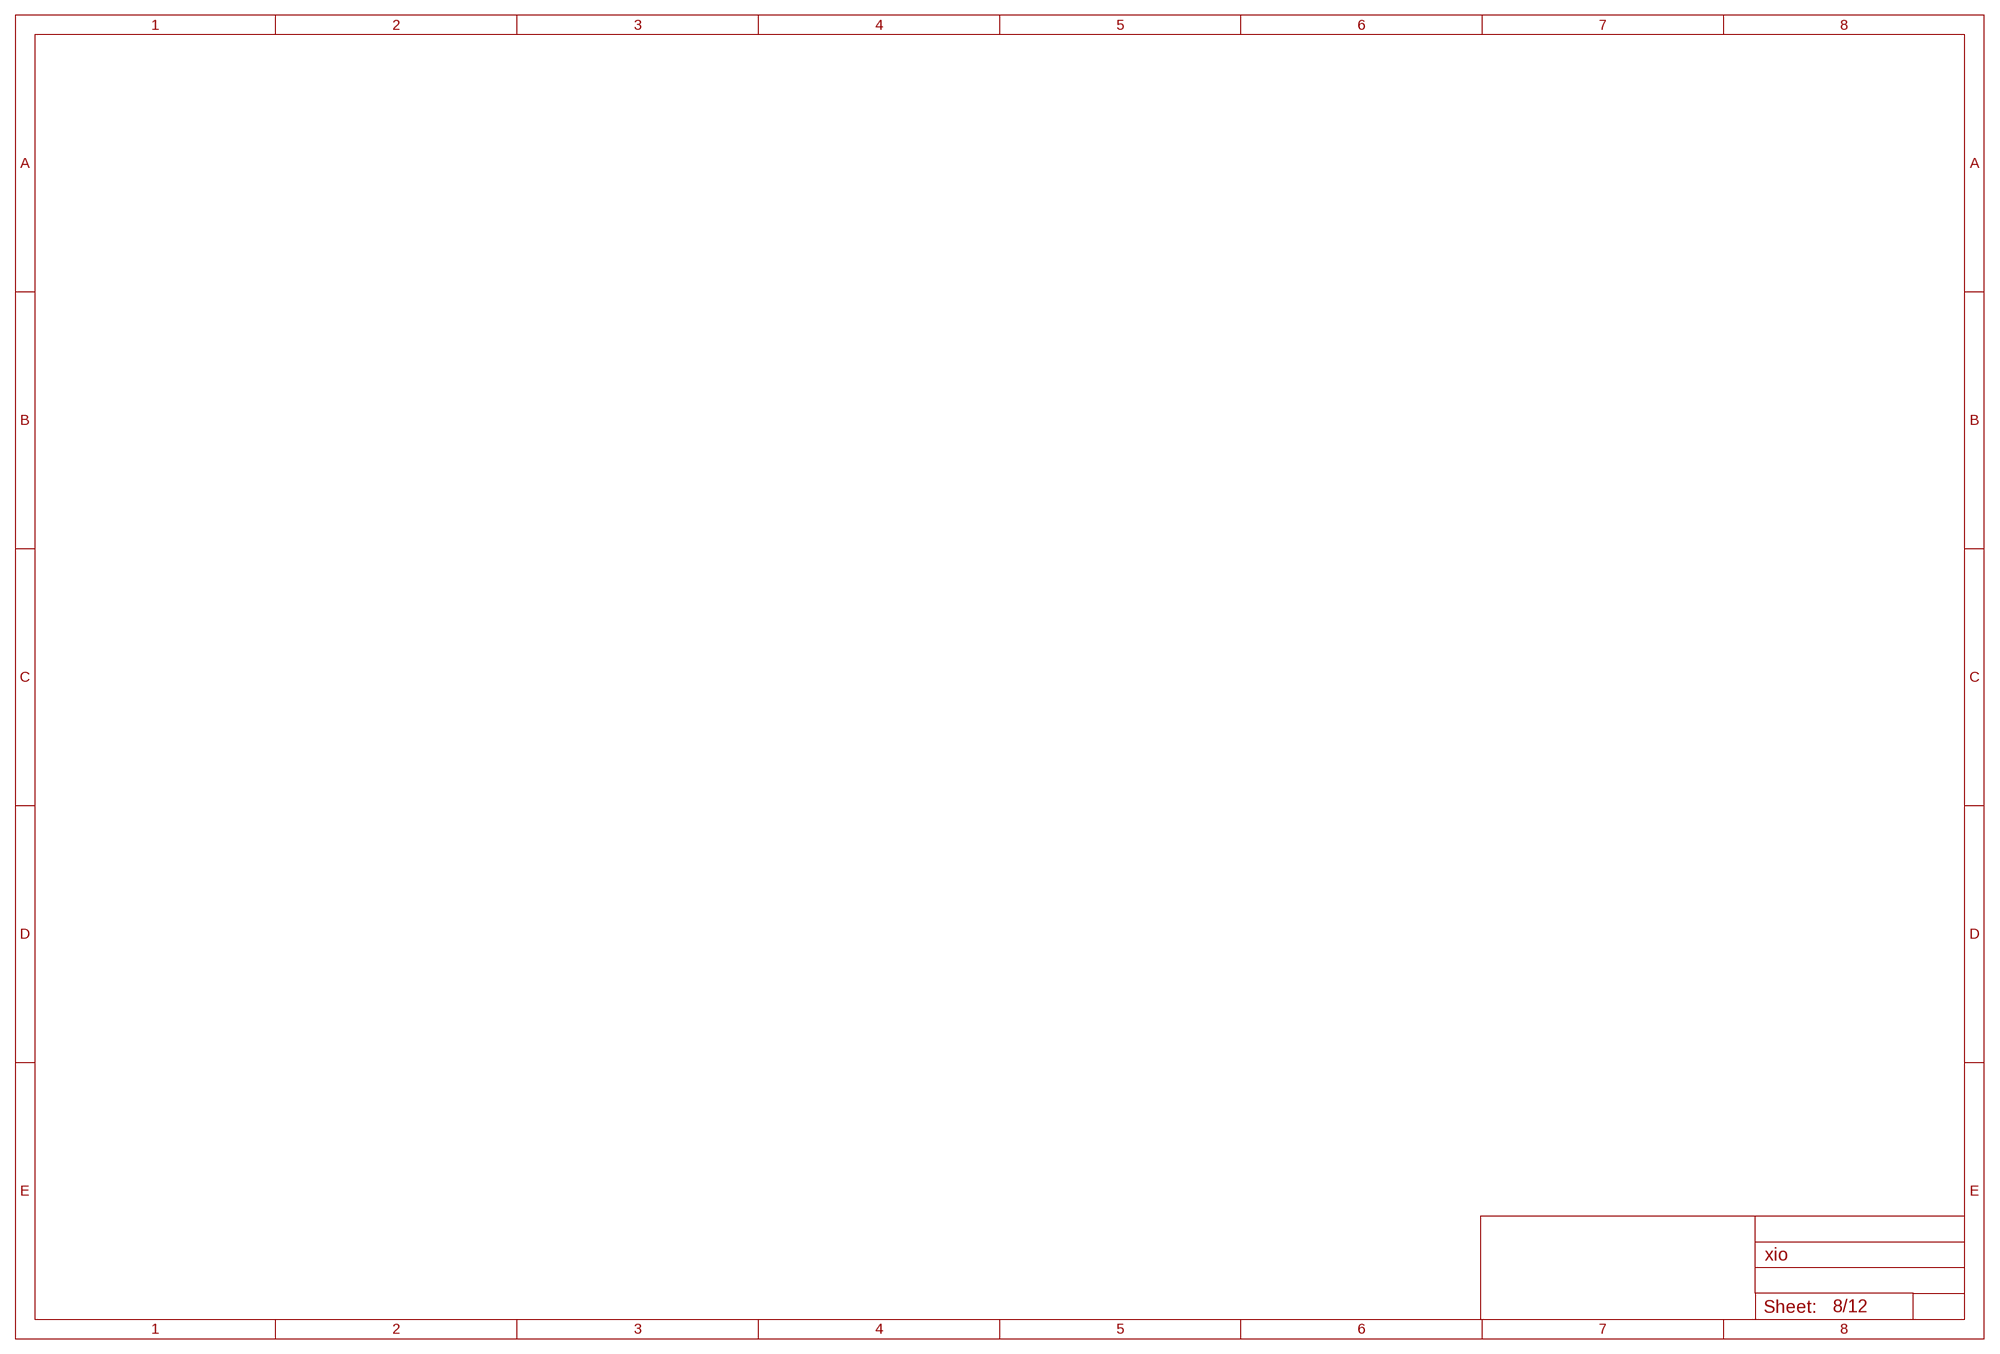
[diagram p8: schematic, sheet 8]

## Sheet 9 of 12
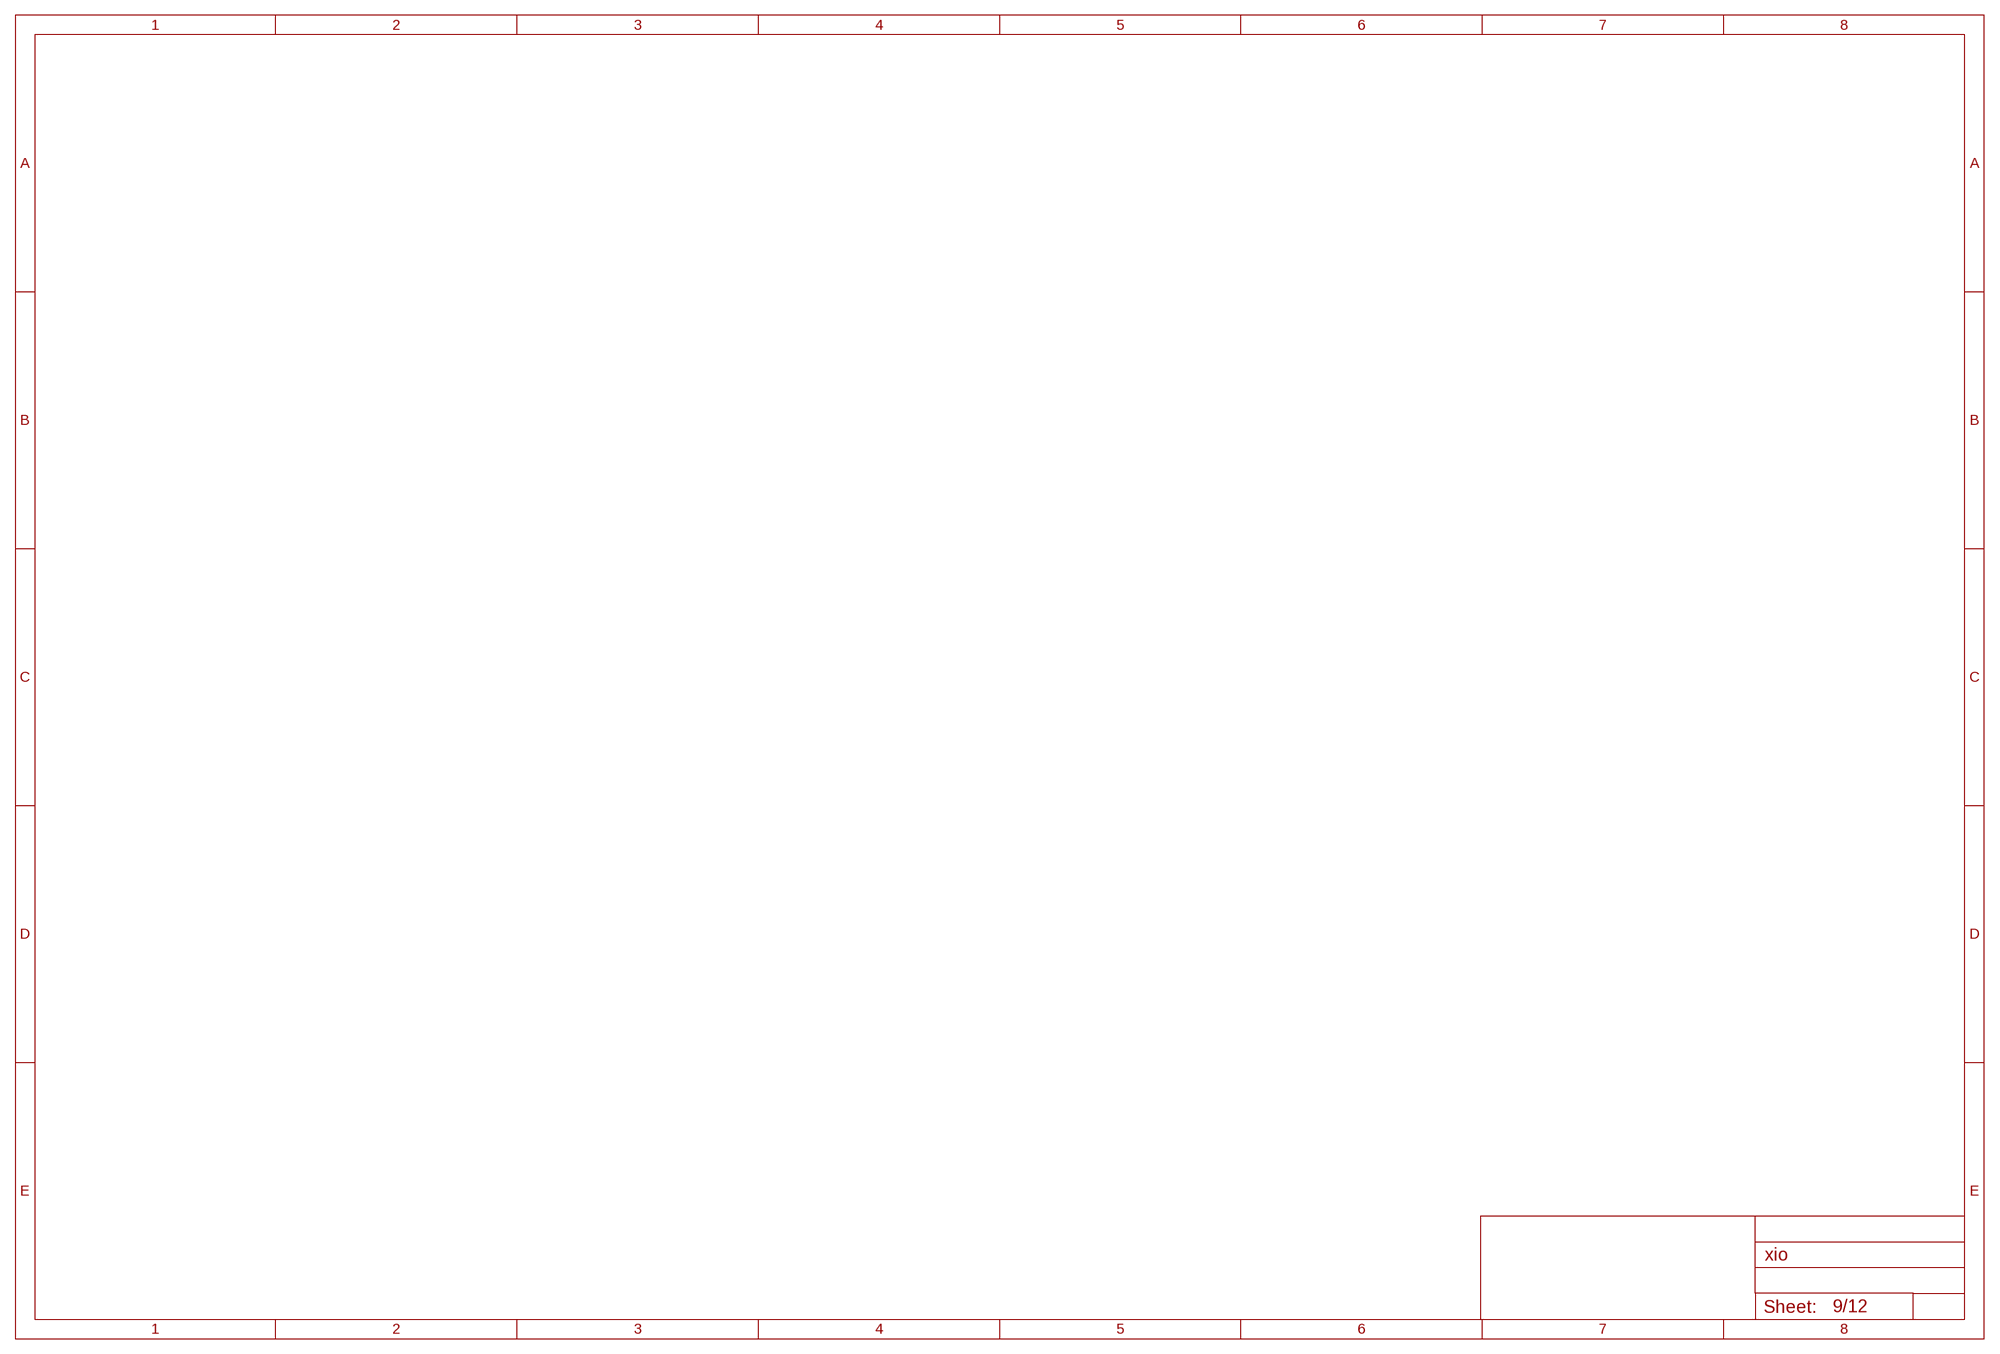
[diagram p9: schematic, sheet 9]

## Sheet 10 of 12
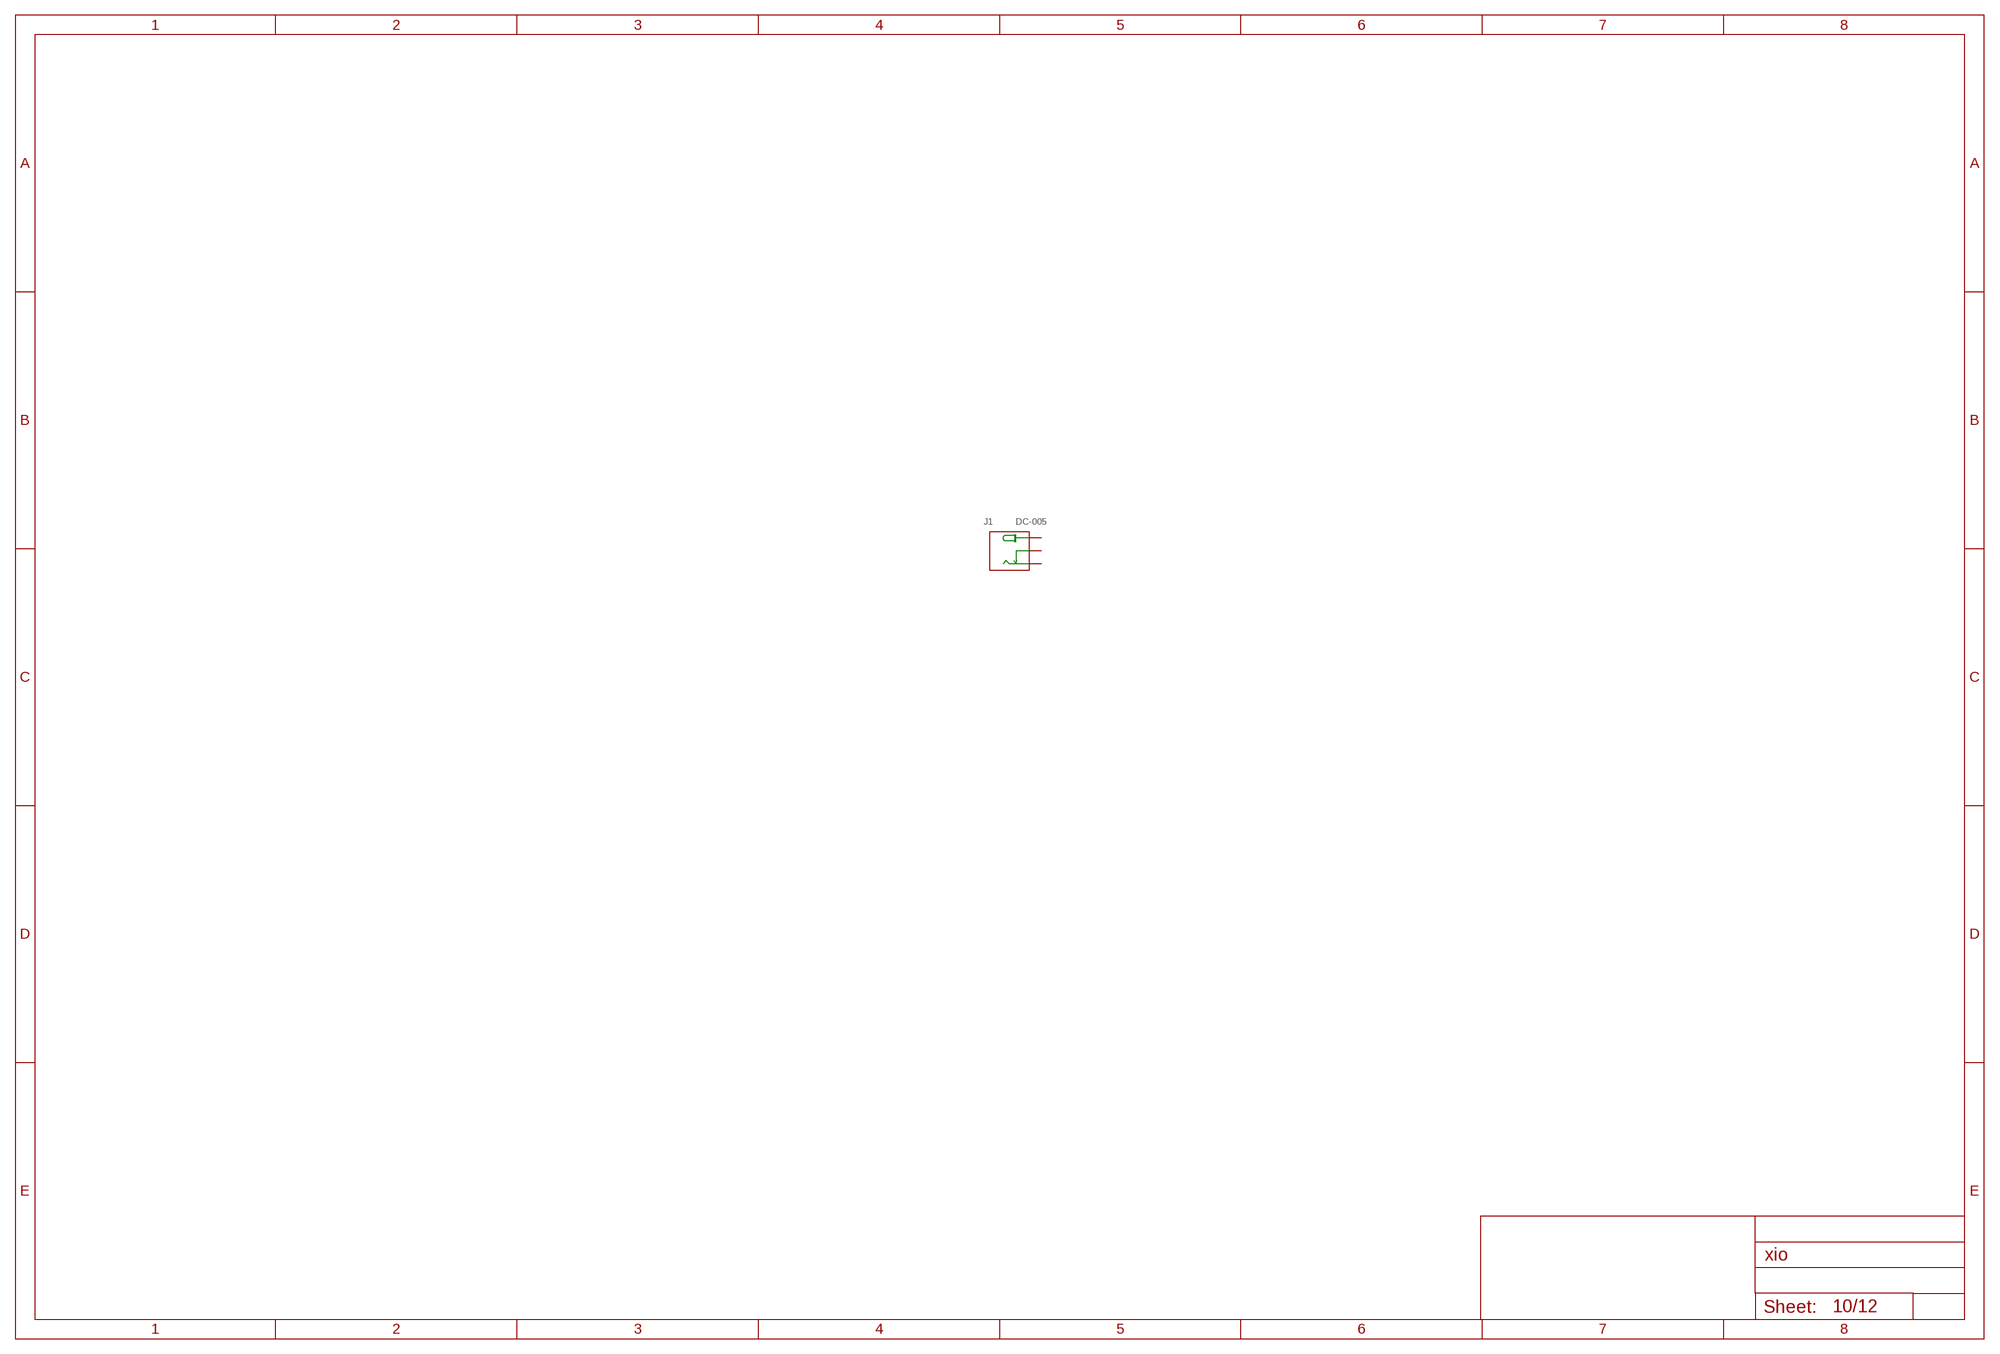
[diagram p10: schematic, sheet 10]

### Parts
J1  DC-005  CONN-POWER-JACK-2.1MM(DC-005)  [DCJ3P-14.2X11.0X9.0MM]
Unconnected: J1.+ J1.-1(-) J1.-2(CDN)

## Sheet 11 of 12
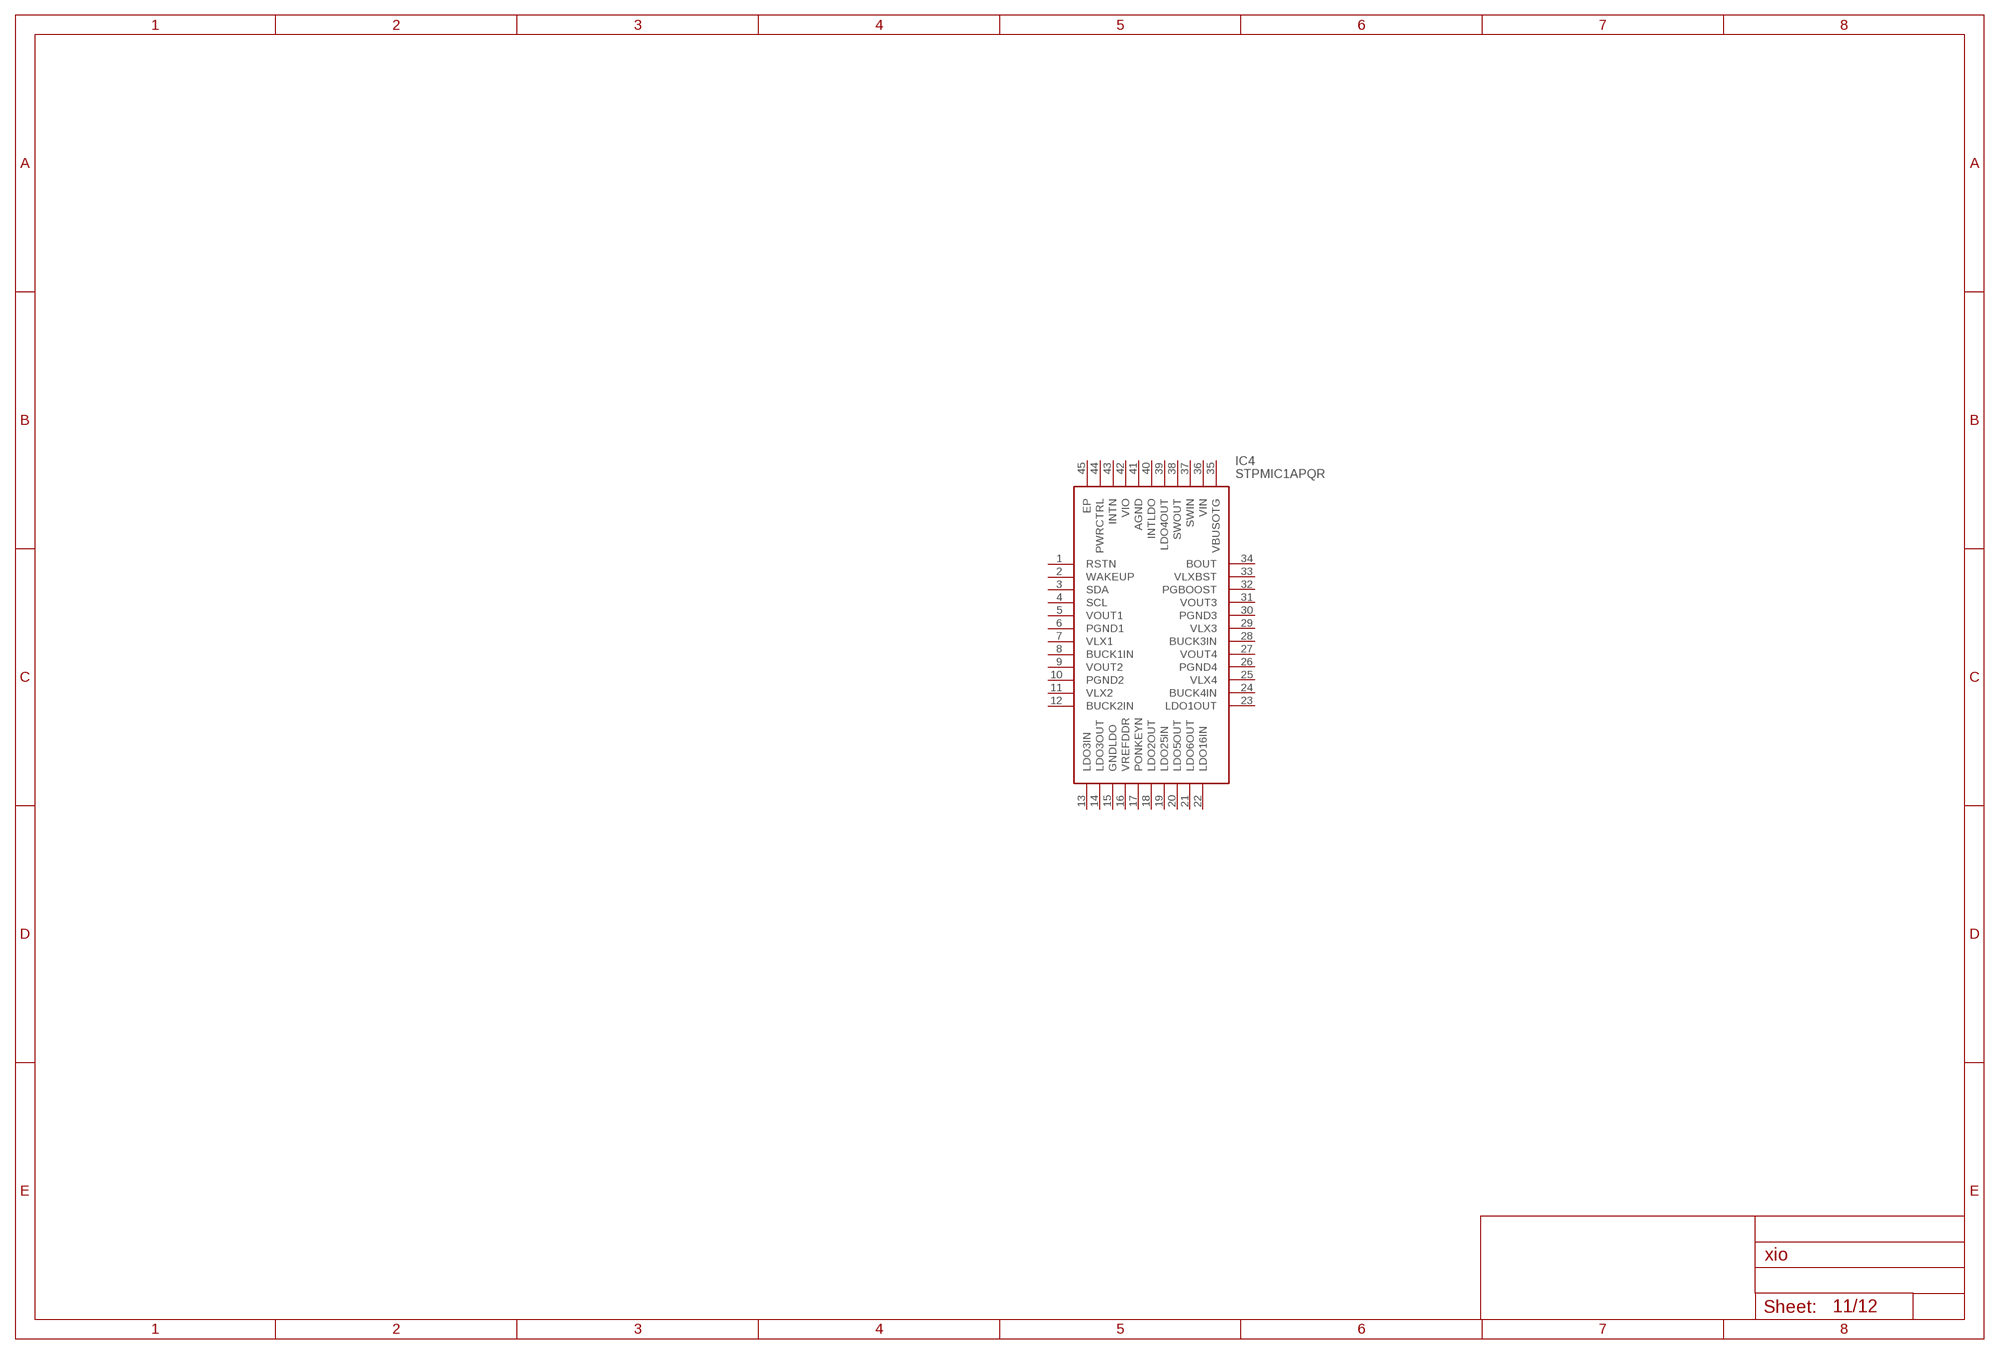
[diagram p11: schematic, sheet 11]

### Parts
IC4  STPMIC1APQR  [QFN40P500X600X80-45N]
Unconnected: IC4.1(RSTN) IC4.2(WAKEUP) IC4.3(SDA) IC4.4(SCL) IC4.5(VOUT1) IC4.6(PGND1) IC4.7(VLX1) IC4.8(BUCK1IN) IC4.9(VOUT2) IC4.10(PGND2) IC4.11(VLX2) IC4.12(BUCK2IN) IC4.13(LDO3IN) IC4.14(LDO3OUT) IC4.15(GNDLDO) IC4.16(VREFDDR) IC4.17(PONKEYN) IC4.18(LDO2OUT) IC4.19(LDO25IN) IC4.20(LDO5OUT) IC4.21(LDO6OUT) IC4.22(LDO16IN) IC4.23(LDO1OUT) IC4.24(BUCK4IN) IC4.25(VLX4) IC4.26(PGND4) IC4.27(VOUT4) IC4.28(BUCK3IN) IC4.29(VLX3) IC4.30(PGND3) IC4.31(VOUT3) IC4.32(PGBOOST) IC4.33(VLXBST) IC4.34(BOUT) IC4.35(VBUSOTG) IC4.36(VIN) IC4.37(SWIN) IC4.38(SWOUT) IC4.39(LDO4OUT) IC4.40(INTLDO) IC4.41(AGND) IC4.42(VIO) IC4.43(INTN) IC4.44(PWRCTRL) IC4.45(EP)

## Sheet 12 of 12

## Library data of the parts
C1 C53 C55 C56 C81 = rcl:C-EU: CAPACITOR, European symbol; SPICEPREFIX: C; USE: GRM033C71C104KE14D
IC4 = samacsys:STPMIC1APQR: STMICROELECTRONICS - STPMIC1APQR - POWER MANAGEMENT IC, WFQFN-44 Source: Datasheet <https://www.st.com/resource/en/datasheet/stpmic1.pdf>; DESCRIPTION: STMICROELECTRONICS - STPMIC1APQR - POWER MANAGEMENT IC, WFQFN-44; HEIGHT: 0.8mm; MANUFACTURER_NAME: STMicroelectronics; MANUFACTURER_PART_NUMBER: STPMIC1APQR; MOUSER_PART_NUMBER: 511-STPMIC1APQR; MOUSER_PRICE-STOCK: https://www.mouser.com/Search/Refine.aspx?Keyword=511-STPMIC1APQR; USE: STPMIC1APQR
J1 = Seeed-Connector:CONN-POWER-JACK-2.1MM(DC-005): 320120003; MPN: DC-005; USE: ADC-029S-4-HT-T/R
LD0 LD1-LD4 = led:LED: LED OSRAM: - CHIPLED LG R971, LG N971, LY N971, LG Q971, LY Q971, LO R971, LY R971 LH N974, LH R974 LS Q976, LO Q976, LY Q976 LO Q996 - Hyper CHIPLED LW Q18S LB Q993, LB Q99A, LB R99A - SideLED LS A670, LO A670, LY A670, LG A670, LP A670 LB A673, LV A673, LT A673, LW A673 LH A674 LY A675 LS A676, LA A676, LO A676, LY A676, LW A676 LS A679, LY A679, LG A679 - Hyper Micro SIDELED® LS Y876, LA Y876, LO Y876, LY Y876 LT Y87S - SmartLED LW L88C, LW L88S LB L89C, LB L89S, LG L890 LS L89K, LO L89K, LY L89K LS L896, LA L896, LO L896, LY L896 - TOPLED LS T670, LO T670, LY T670, LG T670, LP T670 LSG T670, LSP T670, LSY T670, LOP T670, LYG T670 LG T671, LOG T671, LSG T671 LB T673, LV T673, LT T673, LW T673 LH T674 LS T676, LA T676, LO T676, LY T676, LB T676, LH T676, LSB T676, LW T676 LB T67C, LV T67C, LT T67C, LS T67K, LO T67K, LY T67K, LW E67C LS E67B, LA E67B, LO E67B, LY E67B, LB E67C, LV E67C, LT E67C LW T67C LS T679, LY T679, LG T679 LS T770, LO T770, LY T770, LG T770, LP T770 LB T773, LV T773, LT T773, LW T773 LH T774 LS E675, LA E675, LY E675, LS T675 LS T776, LA T776, LO T776, LY T776, LB T776 LHGB T686 LT T68C, LB T68C - Hyper Mini TOPLED® LB M676 - Mini TOPLED Santana® LG M470 LS M47K, LO M47K, LY M47K Source: http://www.osram.convergy.de LUXEON: - LUMILED® LXK2-PW12-R00, LXK2-PW12-S00, LXK2-PW14-U00, LXK2-PW14-V00 LXK2-PM12-R00, LXK2-PM12-S00, LXK2-PM14-U00 LXK2-PE12-Q00, LXK2-PE12-R00, LXK2-PE12-S00, LXK2-PE14-T00, LXK2-PE14-U00 LXK2-PB12-K00, LXK2-PB12-L00, LXK2-PB12-M00, LXK2-PB14-N00, LXK2-PB14-P00, LXK2-PB14-Q00 LXK2-PR12-L00, LXK2-PR12-M00, LXK2-PR14-Q00, LXK2-PR14-R00 LXK2-PD12-Q00, LXK2-PD12-R00, LXK2-PD12-S00 LXK2-PH12-R00, LXK2-PH12-S00 LXK2-PL12-P00, LXK2-PL12-Q00, LXK2-PL12-R00 Source: www.luxeon.com KINGBRIGHT: KA-3528ASYC Source: www.kingbright.com; USE: SML-D12D1WT86
R1-R5 R61-R65 = rcl:R-EU_: RESISTOR, European symbol; SPICEPREFIX: R; USE: ERJ-1GNJ103C
R27 R98 R101 R104 R107 = rcl:R-EU_: RESISTOR, European symbol; SPICEPREFIX: R; USE: RMCF0402FT59R0
SLOT0 SLOT1-SLOT4 = samacsys:10018784-10210TLF: PCI Express / PCI Connectors 36P CARD EDGE ASSM VERTICAL Source: Datasheet <https://componentsearchengine.com/Datasheets/1/10018784-10210TLF.pdf>; DESCRIPTION: PCI Express / PCI Connectors 36P CARD EDGE ASSM VERTICAL; HEIGHT: 11.25mm; MANUFACTURER_NAME: Amphenol; MANUFACTURER_PART_NUMBER: 10018784-10210TLF; MOUSER_PART_NUMBER: 649-1001878410210TLF; MOUSER_PRICE-STOCK: https://www.mouser.com/Search/Refine.aspx?Keyword=649-1001878410210TLF; USE: 10018784-10210TLF
U1 = microbuilder:SDRAM_54TSOP: 64Mb SDRAM (4Mb x 16) Micron: MT48LC4M16A2P-7E:G TR - 133 MHz, 3V-3.6V, 0-70C - Digikey: 557-1089-1-ND MT48LC4M16A2P-75 IT:G TR - 133 MHz, 3V-3.6V, -40-85C - Digikey: 557-1087-1-ND ISSI (cheaper): IS42S16400F-7TL - 143 MHz, 3V-3.6V, 0-70C - Digikey: 706-1077-ND IS42S16400J-7TLI - 143 MHz, 3V-3.6V, -40-85C - Digikey: 706-1132-ND 256Mb SDRAM (16Mb x 16) MT48LC16M16A2TG-7E IT:D TR - 133MHz, 3V-3.6V, -40-85C - Digikey: 557-1064-1-ND; USE: AS4C32M8SA-7TCN
U$1 = pbxl:MPBI+; NOSTUFF: 1
U$2 = sjg-stm32:STM32H753B-PIO; USE: STM32H753BIT6
U$3 = sjg-con:MINI-SAS: Mini-SAS connector, right angle through hole Part 1888019-4 Digikey part A111092CT-ND; USE: 1888019-4

## Net classes
1 Power: width 0.305 mm, drill 0.203 mm
2 Slot-power: width 0.508 mm
3 tx100: width 0.254 mm, clearance 0.457 mm
4 usb90: width 0.254 mm, clearance 0.178 mm
5 cclk50: width 0.203 mm
6 3v3: width 0.254 mm
7 vccint_aux: width 0.305 mm
14 qspi: width 0.203 mm